# EAGLE schematic DMFX-1 v1.2 (EAGLE 6.3), part 1 of 2

## Sheet 1 of 12
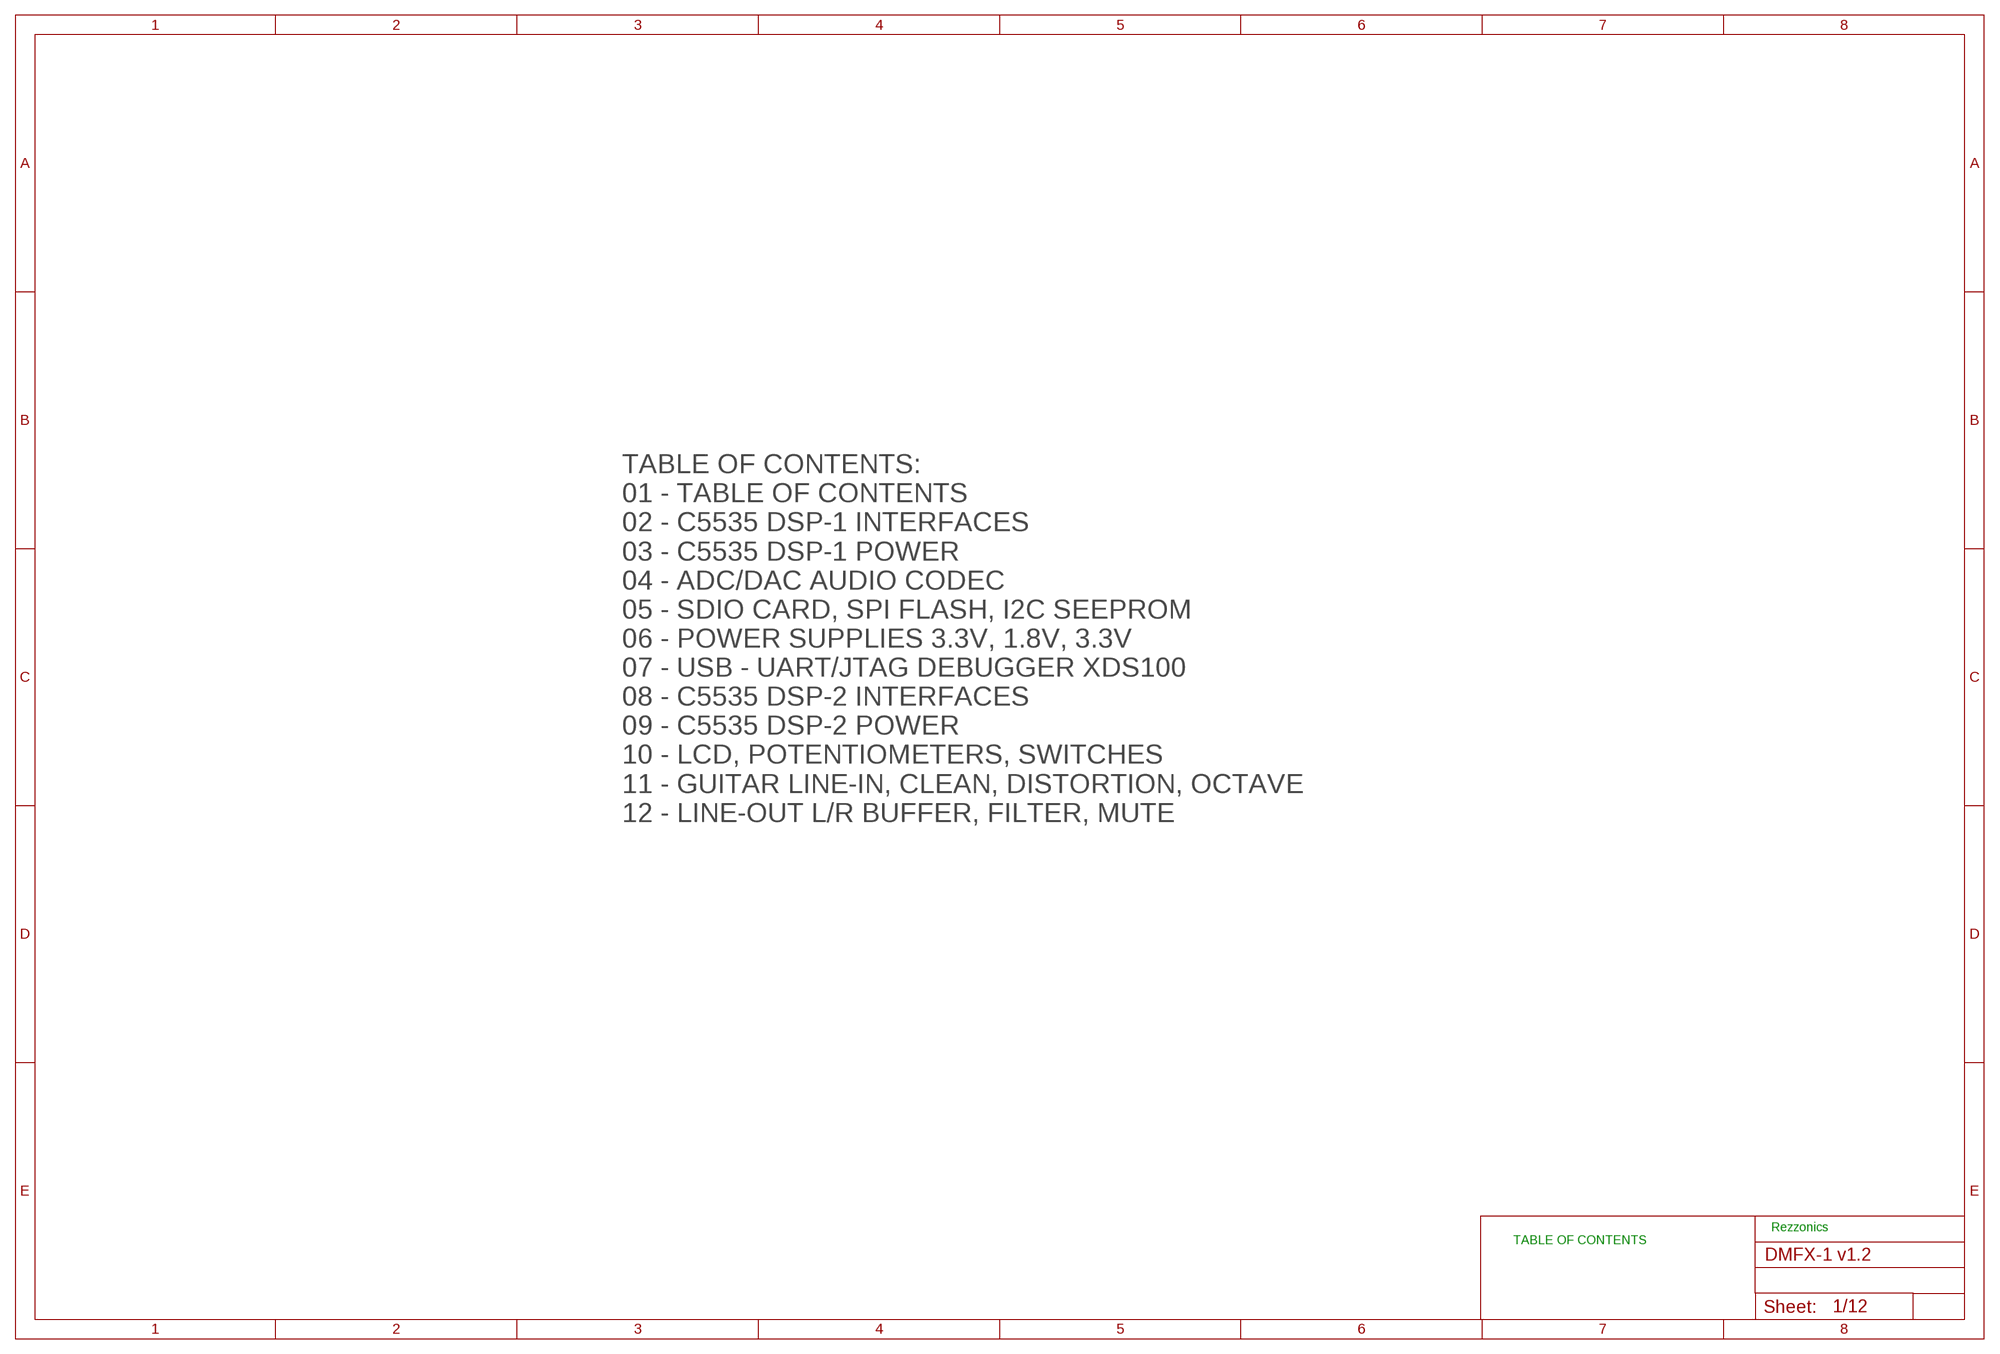
[diagram p0: schematic, sheet 1]

### Notes on the sheet
- TABLE OF CONTENTS:
  01 - TABLE OF CONTENTS
  02 - C5535 DSP-1 INTERFACES
  03 - C5535 DSP-1 POWER
  04 - ADC/DAC AUDIO CODEC
  05 - SDIO CARD, SPI FLASH, I2C SEEPROM
  06 - POWER SUPPLIES 3.3V, 1.8V, 3.3V
  07 - USB - UART/JTAG DEBUGGER XDS100
  08 - C5535 DSP-2 INTERFACES
  09 - C5535 DSP-2 POWER
  10 - LCD, POTENTIOMETERS, SWITCHES
  11 - GUITAR LINE-IN, CLEAN, DISTORTION, OCTAVE
  12 - LINE-OUT L/R BUFFER, FILTER, MUTE
- Rezzonics
- TABLE OF CONTENTS

## Sheet 2 of 12
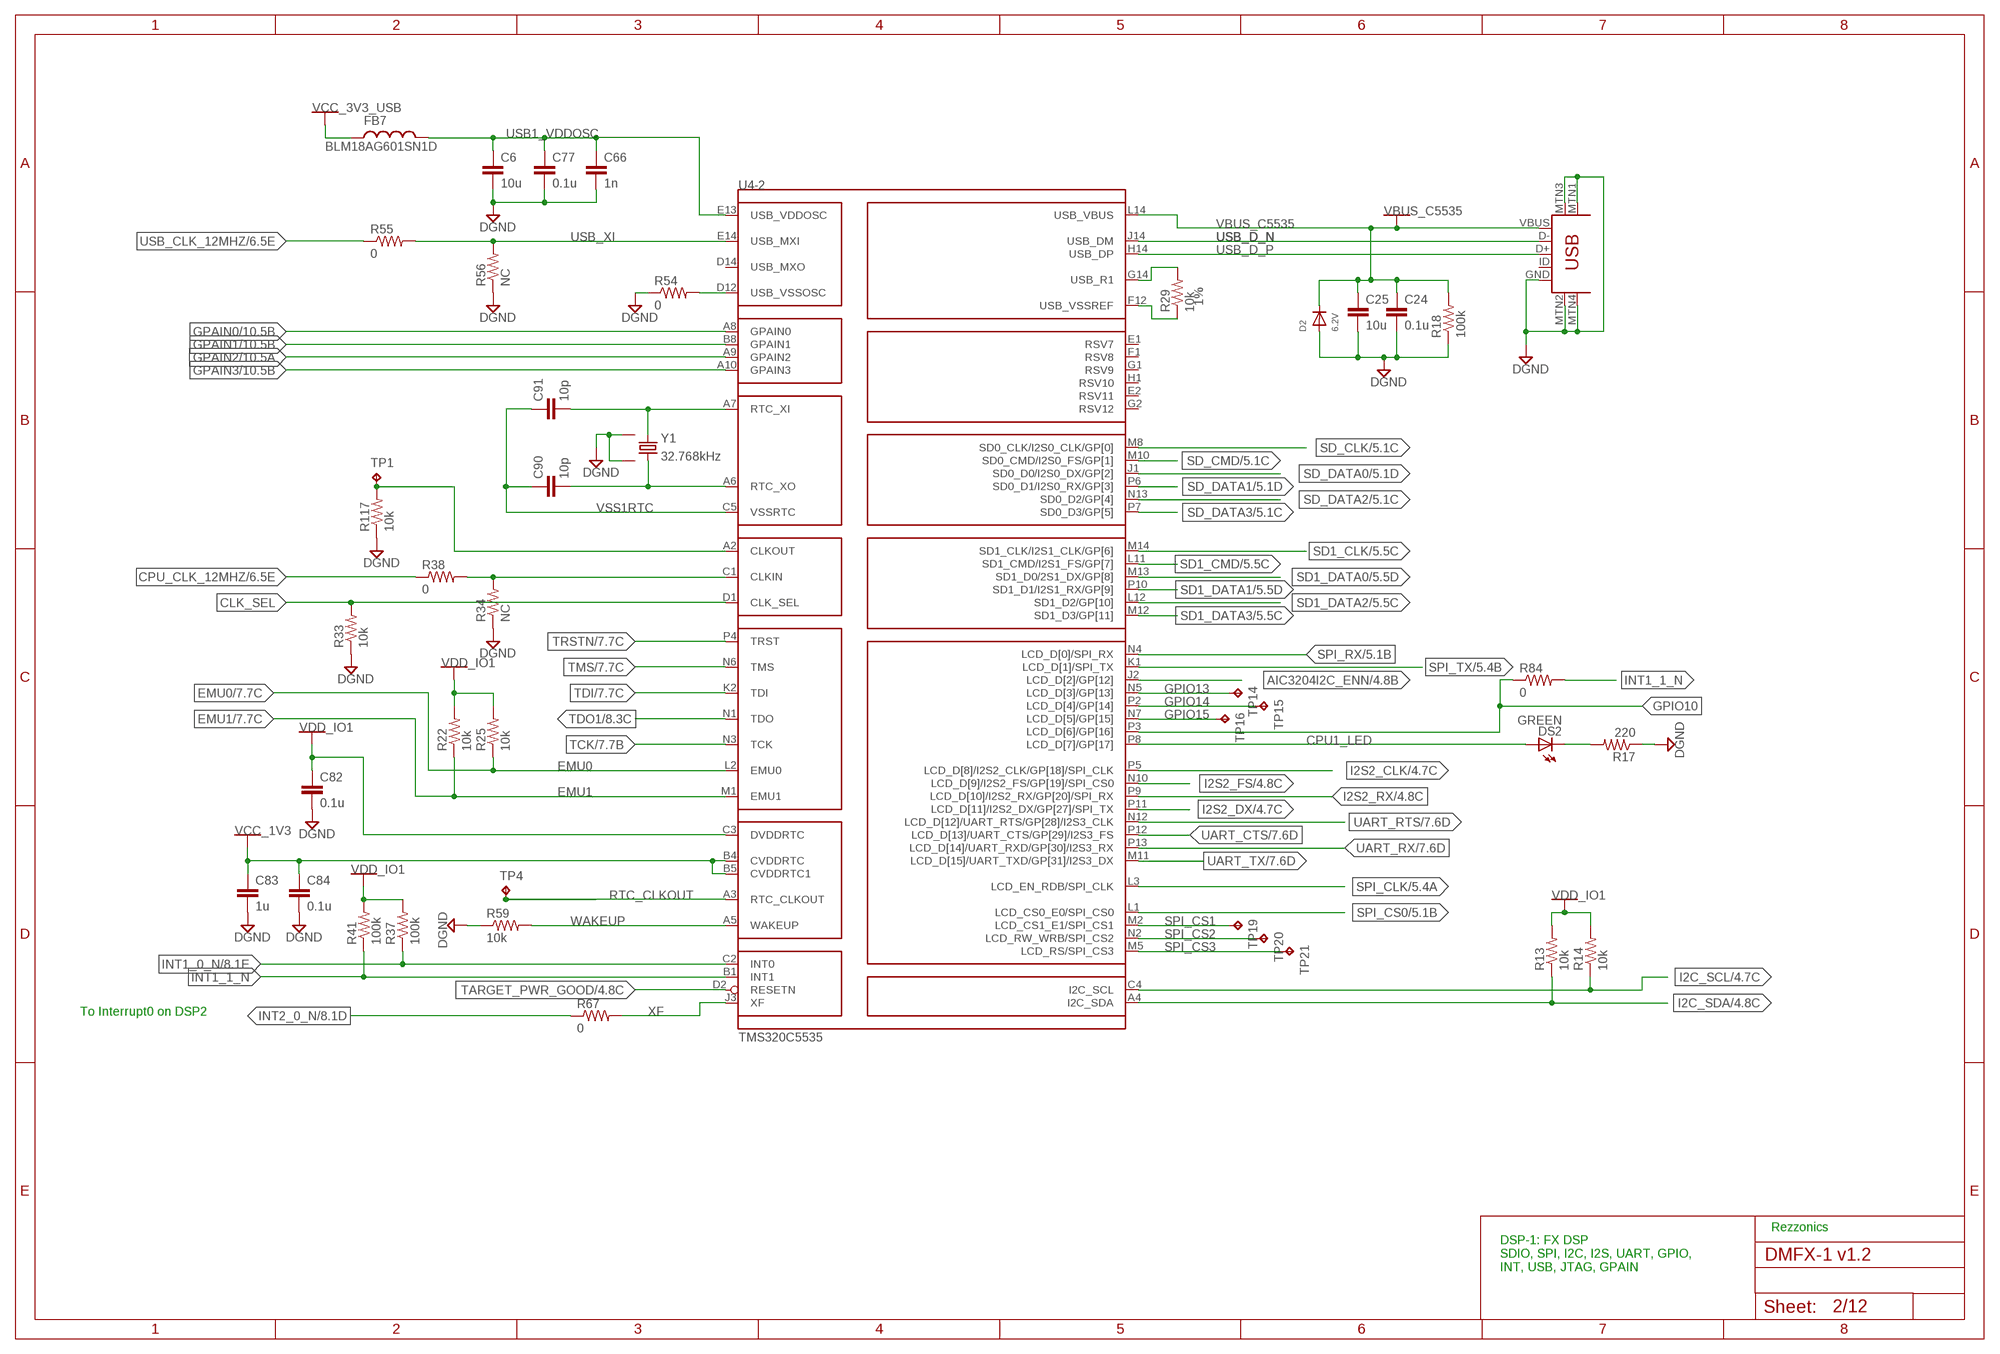
[diagram p1: schematic, sheet 2]

### Parts
C6  10u  C-EUC0603K  [C0603K]
C24  0.1u  C-EUC0402K  [C0402K]
C25  10u  C-EUC0603K  [C0603K]
C66  1n  C0402_BGA  [0402]
C77  0.1u  C-EUC0402K  [C0402K]
C82  0.1u  C0402_BGA  [0402]
C83  1u  C0402_BGA  [0402]
C84  0.1u  C0402_BGA  [0402]
C90  10p  C-EUC0402K  [C0402K]
C91  10p  C-EUC0402K  [C0402K]
D2  6.2V  DIODESMA  [SMADIODE]
DS2  GREEN  LEDCHIPLED_0603  [CHIPLED_0603]
FB7  BLM18AG601SN1D  INDUCTOR0805  [0805]
J1  USB-MINIB-5PIN  [USB-MINIB]
R13  10k  RESISTOR0402-RES  [0402-RES]
R14  10k  RESISTOR0402-RES  [0402-RES]
R17  220  RESISTOR0402-RES  [0402-RES]
R18  100k  RESISTOR0402-RES  [0402-RES]
R22  10k  RESISTOR0402-RES  [0402-RES]
R25  10k  RESISTOR0402-RES  [0402-RES]
R29  10k  CRCW04021K00FKED  [0402]
R33  10k  RESISTOR0402-RES  [0402-RES]
R34  NC  CRCW04021K00FKED  [0402]
R37  100k  RESISTOR0402-RES  [0402-RES]
R38  0  CRCW04021K00FKED  [0402]
R41  100k  RESISTOR0402-RES  [0402-RES]
R54  0  CRCW04021K00FKED  [0402]
R55  0  RESISTOR0402-RES  [0402-RES]
R56  NC  RESISTOR0402-RES  [0402-RES]
R59  10k  RESISTOR0402-RES  [0402-RES]
R67  0  CRCW04021K00FKED  [0402]
R84  0  RESISTOR0402-RES  [0402-RES]
R117  10k  RESISTOR0402-RES  [0402-RES]
TP1  TPTP06R  [TP06R]
TP4  TPTP06R  [TP06R]
TP14  TPTP06R  [TP06R]
TP15  TPTP06R  [TP06R]
TP16  TPTP06R  [TP06R]
TP19  TPTP06R  [TP06R]
TP20  TPTP06R  [TP06R]
TP21  TPTP06R  [TP06R]
U4  TMS320C5535  TMS320C5535S-PBGA-N144  [PBGA144]
Y1  32.768kHz  CRYSTAL  [CRYSTAL-32KHZ-SMD_EPSON_MC146]

### Nets
AIC3204I2C_ENN: U4.J2(-2:LCD_D[2]/GP[12]) ; also sheet 4
CLK_SEL: R33.2 U4.D1(-2:CLK_SEL)
CPU1_LED: DS2.A U4.P8(-2:LCD_D[7]/GP[17])
CPU_CLK_12MHZ: R38.1 ; also sheet 6
DGND [POWER]: C6.2 C24.2 C25.2 C66.2 C77.2 C82.2 C83.2 C84.2 D2.A J1.GND J1.MTN1(MTN2) J1.MTN2(MTN3) J1.MTN3(MTN1) J1.MTN4 R17.1 R18.1 R33.1 R34.1 R54.1 R56.1 R59.1 R117.1 Y1.NC1 Y1.NC2 ; also sheet 3,4,5,6,7,8,9,10,11,12
EMU0: R25.1 U4.L2(-2:EMU0) ; also sheet 7,8
EMU1: R22.1 U4.M1(-2:EMU1) ; also sheet 7,8
GPAIN0: U4.A8(-2:GPAIN0) ; also sheet 10
GPAIN1: U4.B8(-2:GPAIN1) ; also sheet 10
GPAIN2: U4.A9(-2:GPAIN2) ; also sheet 10
GPAIN3: U4.A10(-2:GPAIN3) ; also sheet 10
GPIO10: R84.1 U4.P3(-2:LCD_D[6]/GP[16])
GPIO13: TP14.TP U4.N5(-2:LCD_D[3]/GP[13])
GPIO14: TP15.TP U4.P2(-2:LCD_D[4]/GP[14])
GPIO15: TP16.TP U4.N7(-2:LCD_D[5]/GP[15])
I2C_SCL: R14.1 U4.C4(-2:I2C_SCL) ; also sheet 4,5
I2C_SDA: R13.1 U4.A4(-2:I2C_SDA) ; also sheet 4,5
I2S2_CLK: U4.P5(-2:LCD_D[8]/I2S2_CLK/GP[18]/SPI_CLK) ; also sheet 4
I2S2_DX: U4.P11(-2:LCD_D[11]/I2S2_DX/GP[27]/SPI_TX) ; also sheet 4
I2S2_FS: U4.N10(-2:LCD_D[9]/I2S2_FS/GP[19]/SPI_CS0) ; also sheet 4
I2S2_RX: U4.P9(-2:LCD_D[10]/I2S2_RX/GP[20]/SPI_RX) ; also sheet 4
INT1_0_N: R37.1 U4.C2(-2:INT0) ; also sheet 8
INT1_1_N: R41.1 R84.2 U4.B1(-2:INT1)
INT2_0_N: R67.1 ; also sheet 8
N$5: C91.2 U4.A7(-2:RTC_XI) Y1.P$2
N$14: C90.2 U4.A6(-2:RTC_XO) Y1.P$1
N$17: R117.2 TP1.TP U4.A2(-2:CLKOUT)
N$18: R34.2 R38.2 U4.C1(-2:CLKIN)
N$20: DS2.C R17.2
N$21: R29.2 U4.G14(-2:USB_R1)
RTC_CLKOUT: TP4.TP U4.A3(-2:RTC_CLKOUT)
SD1_CLK: U4.M14(-2:SD1_CLK/I2S1_CLK/GP[6]) ; also sheet 5
SD1_CMD: U4.L11(-2:SD1_CMD/I2S1_FS/GP[7]) ; also sheet 5
SD1_DATA0: U4.M13(-2:SD1_D0/2S1_DX/GP[8]) ; also sheet 5
SD1_DATA1: U4.P10(-2:SD1_D1/I2S1_RX/GP[9]) ; also sheet 5
SD1_DATA2: U4.L12(-2:SD1_D2/GP[10]) ; also sheet 5
SD1_DATA3: U4.M12(-2:SD1_D3/GP[11]) ; also sheet 5
SD_CLK: U4.M8(-2:SD0_CLK/I2S0_CLK/GP[0]) ; also sheet 5
SD_CMD: U4.M10(-2:SD0_CMD/I2S0_FS/GP[1]) ; also sheet 5
SD_DATA0: U4.J1(-2:SD0_D0/I2S0_DX/GP[2]) ; also sheet 5
SD_DATA1: U4.P6(-2:SD0_D1/I2S0_RX/GP[3]) ; also sheet 5
SD_DATA2: U4.N13(-2:SD0_D2/GP[4]) ; also sheet 5
SD_DATA3: U4.P7(-2:SD0_D3/GP[5]) ; also sheet 5
SPI_CLK: U4.L3(-2:LCD_EN_RDB/SPI_CLK) ; also sheet 5
SPI_CS0: U4.L1(-2:LCD_CS0_E0/SPI_CS0) ; also sheet 5
SPI_CS1: TP19.TP U4.M2(-2:LCD_CS1_E1/SPI_CS1)
SPI_CS2: TP20.TP U4.N2(-2:LCD_RW_WRB/SPI_CS2)
SPI_CS3: TP21.TP U4.M5(-2:LCD_RS/SPI_CS3)
SPI_RX: U4.N4(-2:LCD_D[0]/SPI_RX) ; also sheet 5
SPI_TX: U4.K1(-2:LCD_D[1]/SPI_TX) ; also sheet 5
TARGET_PWR_GOOD: U4.D2(-2:RESETN) ; also sheet 4,6,7,8,10
TCK: U4.N3(-2:TCK) ; also sheet 7,8
TDI: U4.K2(-2:TDI) ; also sheet 7
TDO1: U4.N1(-2:TDO) ; also sheet 8
TMS: U4.N6(-2:TMS) ; also sheet 7,8
TRSTN: U4.P4(-2:TRST) ; also sheet 7,8
UART_CTS: U4.P12(-2:LCD_D[13]/UART_CTS/GP[29]/I2S3_FS) ; also sheet 7
UART_RTS: U4.N12(-2:LCD_D[12]/UART_RTS/GP[28]/I2S3_CLK) ; also sheet 7
UART_RX: U4.P13(-2:LCD_D[14]/UART_RXD/GP[30]/I2S3_RX) ; also sheet 7
UART_TX: U4.M11(-2:LCD_D[15]/UART_TXD/GP[31]/I2S3_DX) ; also sheet 7
USB1_VDDOSC [POWER]: C6.1 C66.1 C77.1 FB7.2 U4.E13(-2:USB_VDDOSC)
USB1_VSSOSC: R54.2 U4.D12(-2:USB_VSSOSC)
USB1_VSSREF: R29.1 U4.F12(-2:USB_VSSREF)
USB_CLK_12MHZ: R55.1 ; also sheet 6
USB_D_N: J1.D- U4.J14(-2:USB_DM)
USB_D_P: J1.D+ U4.H14(-2:USB_DP)
USB_XI: R55.2 R56.2 U4.E14(-2:USB_MXI)
VBUS_C5535 [POWER]: C24.1 C25.1 D2.C J1.VBUS R18.2 U4.L14(-2:USB_VBUS) ; also sheet 7
VCC_1V3: C83.1 C84.1 U4.B4(-2:CVDDRTC) U4.B5(-2:CVDDRTC1) ; also sheet 3,6,8,9
VCC_3V3_USB [POWER]: FB7.1 ; also sheet 3,6,8,9
VDD_IO1: C82.1 R13.2 R14.2 R22.2 R25.2 R37.2 R41.2 U4.C3(-2:DVDDRTC) ; also sheet 5,6
VSS1RTC: C90.1 C91.1 U4.C5(-2:VSSRTC)
WAKEUP: R59.2 U4.A5(-2:WAKEUP)
XF: R67.2 U4.J3(-2:XF)
Unconnected: J1.ID U4.D14(-2:USB_MXO) U4.E1(-2:RSV7) U4.E2(-2:RSV11) U4.F1(-2:RSV8) U4.G1(-2:RSV9) U4.G2(-2:RSV12) U4.H1(-2:RSV10)

### Notes on the sheet
- To Interrupt0 on DSP2
- Rezzonics
- DSP-1: FX DSP
  SDIO, SPI, I2C, I2S, UART, GPIO, 
  INT, USB, JTAG, GPAIN

## Sheet 3 of 12
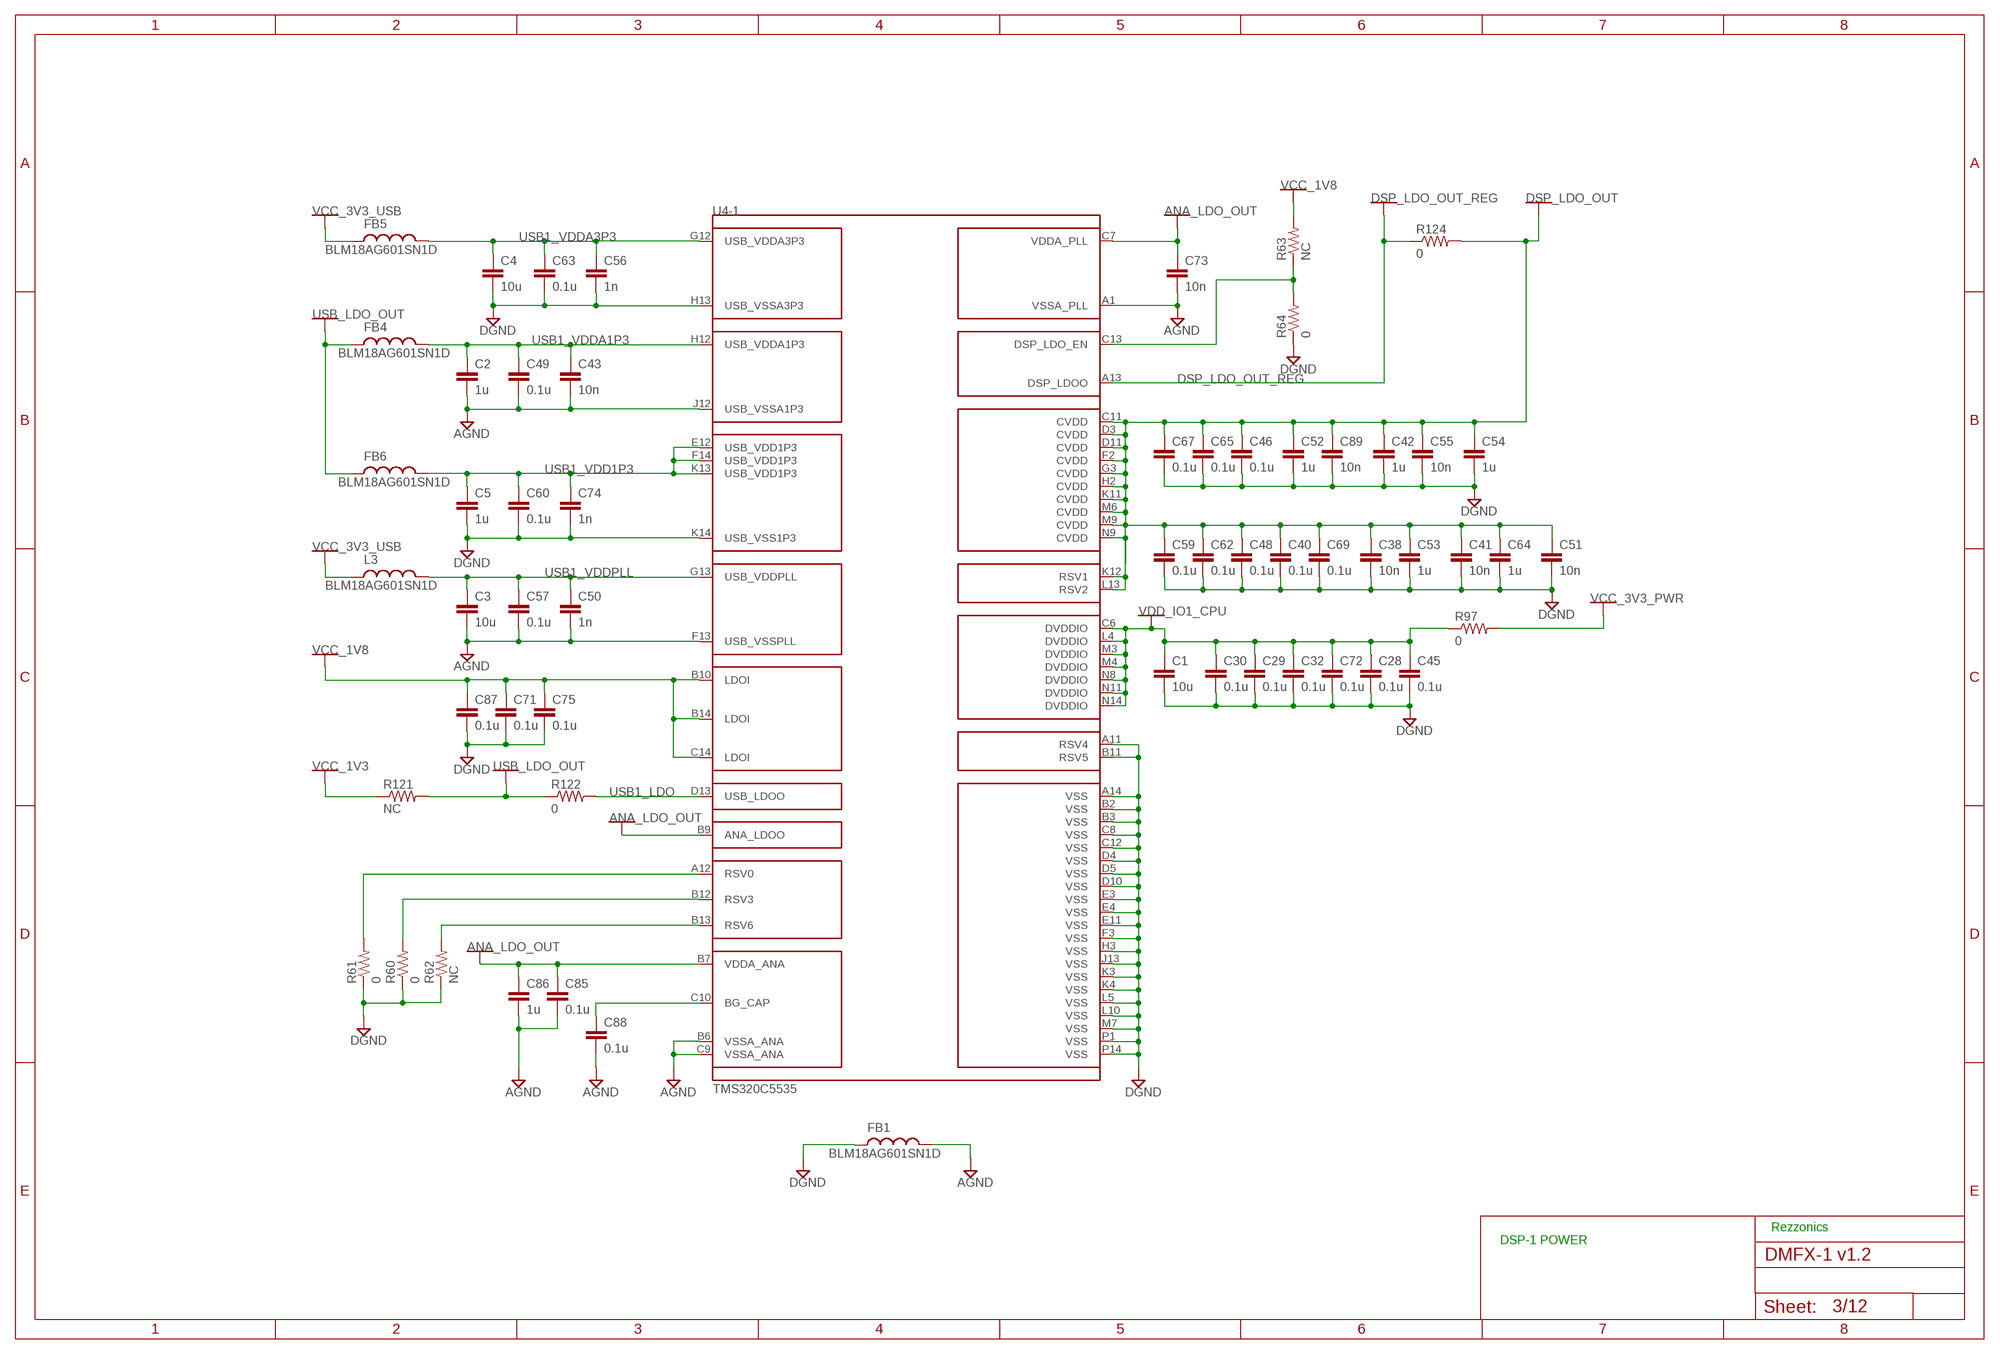
[diagram p2: schematic, sheet 3]

### Parts
C1  10u  C-EUC0603K  [C0603K]
C2  1u  C-EUC0402K  [C0402K]
C3  10u  C-EUC0603K  [C0603K]
C4  10u  C-EUC0603K  [C0603K]
C5  1u  C-EUC0402K  [C0402K]
C28  0.1u  C-EUC0402K  [C0402K]
C29  0.1u  C-EUC0402K  [C0402K]
C30  0.1u  C-EUC0402K  [C0402K]
C32  0.1u  C0402_BGA  [0402]
C38  10n  C0402_BGA  [0402]
C40  0.1u  C0402_BGA  [0402]
C41  10n  C0402_BGA  [0402]
C42  1u  C0402_BGA  [0402]
C43  10n  C0402_BGA  [0402]
C45  0.1u  C0402_BGA  [0402]
C46  0.1u  C0402_BGA  [0402]
C48  0.1u  C0402_BGA  [0402]
C49  0.1u  C0402_BGA  [0402]
C50  1n  C0402_BGA  [0402]
C51  10n  C0402_BGA  [0402]
C52  1u  C0402_BGA  [0402]
C53  1u  C0402_BGA  [0402]
C54  1u  C0402_BGA  [0402]
C55  10n  C0402_BGA  [0402]
C56  1n  C0402_BGA  [0402]
C57  0.1u  C0402_BGA  [0402]
C59  0.1u  C0402_BGA  [0402]
C60  0.1u  C0402_BGA  [0402]
C62  0.1u  C0402_BGA  [0402]
C63  0.1u  C0402_BGA  [0402]
C64  1u  C0402_BGA  [0402]
C65  0.1u  C0402_BGA  [0402]
C67  0.1u  C0402_BGA  [0402]
C69  0.1u  C0402_BGA  [0402]
C71  0.1u  C0402_BGA  [0402]
C72  0.1u  C0402_BGA  [0402]
C73  10n  C0402_BGA  [0402]
C74  1n  C-EUC0402K  [C0402K]
C75  0.1u  C0402_BGA  [0402]
C85  0.1u  C0402_BGA  [0402]
C86  1u  C0402_BGA  [0402]
C87  0.1u  C0402_BGA  [0402]
C88  0.1u  C0402_BGA  [0402]
C89  10n  C-EUC0402K  [C0402K]
FB1  BLM18AG601SN1D  INDUCTOR0603  [0603]
FB4  BLM18AG601SN1D  INDUCTOR0603  [0603]
FB5  BLM18AG601SN1D  INDUCTOR0603  [0603]
FB6  BLM18AG601SN1D  INDUCTOR0603  [0603]
L3  BLM18AG601SN1D  INDUCTOR0603  [0603]
R60  0  RESISTOR0402-RES  [0402-RES]
R61  0  RESISTOR0402-RES  [0402-RES]
R62  NC  RESISTOR0402-RES  [0402-RES]
R63  NC  RESISTOR0402-RES  [0402-RES]
R64  0  RESISTOR0402-RES  [0402-RES]
R97  0  RESISTOR0805-RES  [0805]
R121  NC  RESISTOR0805-RES  [0805]
R122  0  RESISTOR0805-RES  [0805]
R124  0  RESISTOR0805-RES  [0805]

### Nets
AGND [POWER]: C2.2 C3.2 C43.2 C49.2 C50.2 C57.2 C73.2 C85.2 C86.2 C88.2 FB1.2 U4.A1(-1:VSSA_PLL) U4.B6(-1:VSSA_ANA) U4.C9(-1:VSSA_ANA) U4.F13(-1:USB_VSSPLL) U4.J12(-1:USB_VSSA1P3) ; also sheet 9
ANA_LDO_OUT: C73.1 C85.1 C86.1 U4.B7(-1:VDDA_ANA) U4.B9(-1:ANA_LDOO) U4.C7(-1:VDDA_PLL)
DGND [POWER]: C1.2 C4.2 C5.2 C28.2 C29.2 C30.2 C32.2 C38.2 C40.2 C41.2 C42.2 C45.2 C46.2 C48.2 C51.2 C52.2 C53.2 C54.2 C55.2 C56.2 C59.2 C60.2 C62.2 C63.2 C64.2 C65.2 C67.2 C69.2 C71.2 C72.2 C74.2 C75.2 C87.2 C89.2 FB1.1 R60.1 R61.1 R62.1 R64.1 U4.A11(-1:RSV4) U4.A14(-1:VSS) U4.B2(-1:VSS) U4.B3(-1:VSS) U4.B11(-1:RSV5) U4.C8(-1:VSS) U4.C12(-1:VSS) U4.D4(-1:VSS) U4.D5(-1:VSS) U4.D10(-1:VSS) U4.E3(-1:VSS) U4.E4(-1:VSS) U4.E11(-1:VSS) U4.F3(-1:VSS) U4.H3(-1:VSS) U4.H13(-1:USB_VSSA3P3) U4.J13(-1:VSS) U4.K3(-1:VSS) U4.K4(-1:VSS) U4.K14(-1:USB_VSS1P3) U4.L5(-1:VSS) U4.L10(-1:VSS) U4.M7(-1:VSS) U4.P1(-1:VSS) U4.P14(-1:VSS) ; also sheet 2,4,5,6,7,8,9,10,11,12
DSP_LDO_OUT: C38.1 C40.1 C41.1 C42.1 C46.1 C48.1 C51.1 C52.1 C53.1 C54.1 C55.1 C59.1 C62.1 C64.1 C65.1 C67.1 C69.1 C89.1 R124.2 U4.C11(-1:CVDD) U4.D3(-1:CVDD) U4.D11(-1:CVDD) U4.F2(-1:CVDD) U4.G3(-1:CVDD) U4.H2(-1:CVDD) U4.K11(-1:CVDD) U4.K12(-1:RSV1) U4.L13(-1:RSV2) U4.M6(-1:CVDD) U4.M9(-1:CVDD) U4.N9(-1:CVDD)
DSP_LDO_OUT_REG: R124.1 U4.A13(-1:DSP_LDOO)
N$1: R63.1 R64.2 U4.C13(-1:DSP_LDO_EN)
N$11: R61.2 U4.A12(-1:RSV0)
N$12: R60.2 U4.B12(-1:RSV3)
N$13: R62.2 U4.B13(-1:RSV6)
N$15: C88.1 U4.C10(-1:BG_CAP)
USB1_LDO: R122.2 U4.D13(-1:USB_LDOO)
USB1_VDD1P3 [POWER]: C5.1 C60.1 C74.1 FB6.2 U4.E12(-1:USB_VDD1P3) U4.F14(-1:USB_VDD1P3) U4.K13(-1:USB_VDD1P3)
USB1_VDDA1P3 [POWER]: C2.1 C43.1 C49.1 FB4.2 U4.H12(-1:USB_VDDA1P3)
USB1_VDDA3P3: C4.1 C56.1 C63.1 FB5.2 U4.G12(-1:USB_VDDA3P3)
USB1_VDDPLL: C3.1 C50.1 C57.1 L3.2 U4.G13(-1:USB_VDDPLL)
USB_LDO_OUT: FB4.1 FB6.1 R121.2 R122.1
VCC_1V3: R121.1 ; also sheet 2,6,8,9
VCC_1V8: C71.1 C75.1 C87.1 R63.2 U4.B10(-1:LDOI) U4.B14(-1:LDOI) U4.C14(-1:LDOI) ; also sheet 4,6,9
VCC_3V3_PWR: R97.2 ; also sheet 6,9
VCC_3V3_USB [POWER]: FB5.1 L3.1 ; also sheet 2,6,8,9
VDD_IO1_CPU [POWER]: C1.1 C28.1 C29.1 C30.1 C32.1 C45.1 C72.1 R97.1 U4.C6(-1:DVDDIO) U4.L4(-1:DVDDIO) U4.M3(-1:DVDDIO) U4.M4(-1:DVDDIO) U4.N8(-1:DVDDIO) U4.N11(-1:DVDDIO) U4.N14(-1:DVDDIO)

### Notes on the sheet
- Rezzonics
- DSP-1 POWER

## Sheet 4 of 12
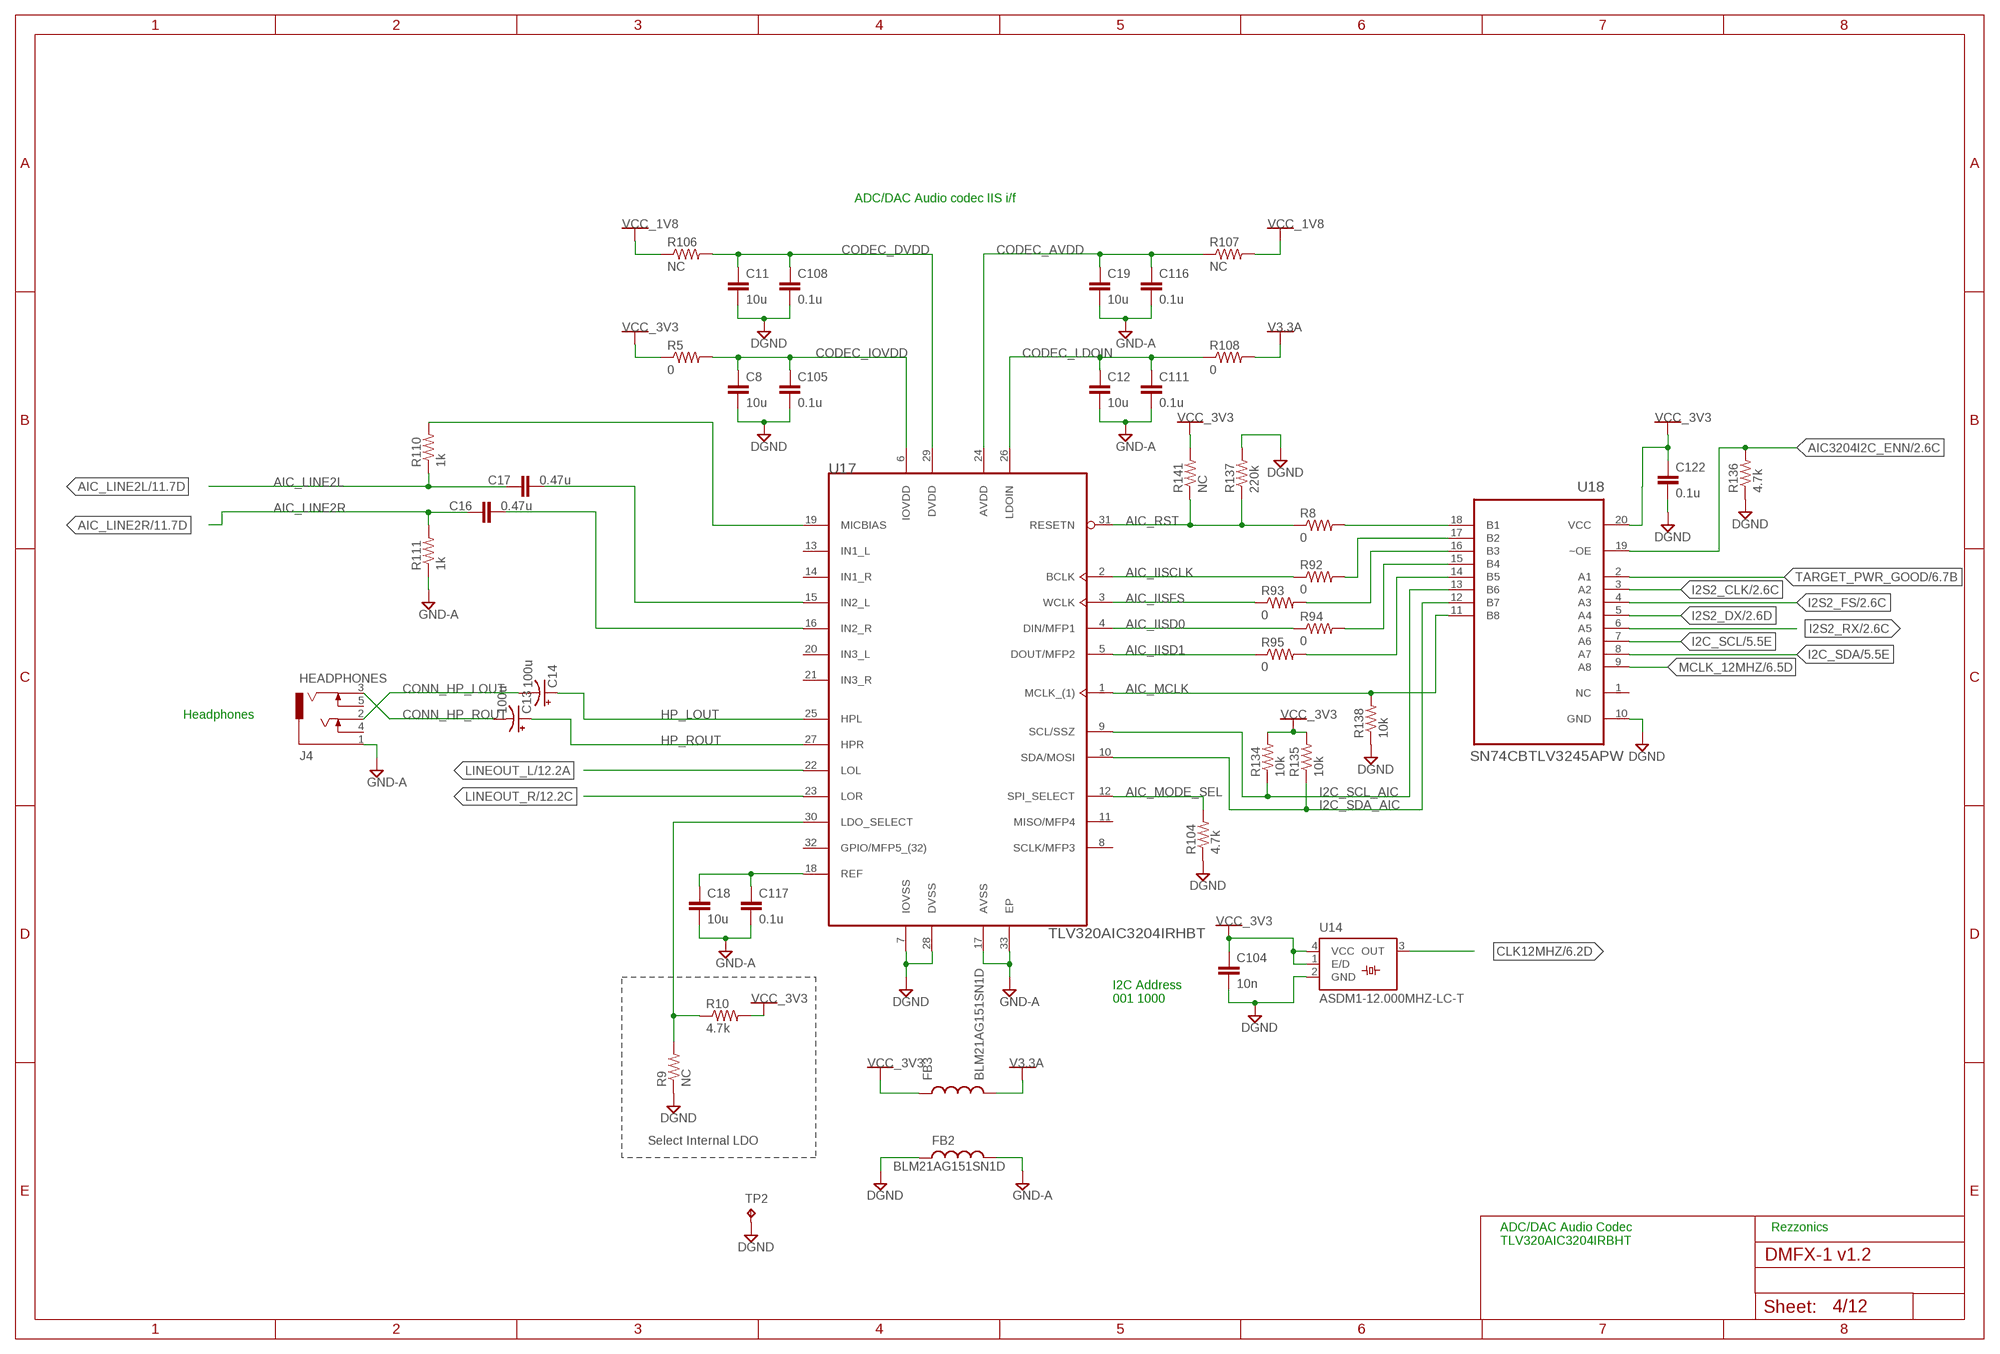
[diagram p3: schematic, sheet 4]

### Parts
C8  10u  C-EUC0603K  [C0603K]
C11  10u  C-EUC0603K  [C0603K]
C12  10u  C-EUC0603K  [C0603K]
C13  100u  CPOL-US1411  [1411]
C14  100u  CPOL-US1411  [1411]
C16  0.47u  C-EUC0603K  [C0603K]
C17  0.47u  C-EUC0603K  [C0603K]
C18  10u  C-EUC0603K  [C0603K]
C19  10u  C-EUC0603K  [C0603K]
C104  10n  C-EUC0402K  [C0402K]
C105  0.1u  C-EUC0402K  [C0402K]
C108  0.1u  C-EUC0402K  [C0402K]
C111  0.1u  C-EUC0402K  [C0402K]
C116  0.1u  C-EUC0402K  [C0402K]
C117  0.1u  C-EUC0402K  [C0402K]
C122  0.1u  C-EUC0402K  [C0402K]
FB2  BLM21AG151SN1D  INDUCTOR0805  [0805]
FB3  BLM21AG151SN1D  INDUCTOR0805  [0805]
J4  HEADPHONES  AUDIOJACK3_5SMD  [AUDIO-JACK-3.5MM-SMD]
R5  0  RESISTOR0402-RES  [0402-RES]
R8  0  RESISTOR0402-RES  [0402-RES]
R9  NC  RESISTOR0603-RES  [0603-RES]
R10  4.7k  RESISTOR0603-RES  [0603-RES]
R92  0  RESISTOR0402-RES  [0402-RES]
R93  0  RESISTOR0402-RES  [0402-RES]
R94  0  RESISTOR0402-RES  [0402-RES]
R95  0  RESISTOR0402-RES  [0402-RES]
R104  4.7k  RESISTOR0402-RES  [0402-RES]
R106  NC  RESISTOR0402-RES  [0402-RES]
R107  NC  RESISTOR0402-RES  [0402-RES]
R108  0  RESISTOR0402-RES  [0402-RES]
R110  1k  RESISTOR0402-RES  [0402-RES]
R111  1k  RESISTOR0402-RES  [0402-RES]
R134  10k  RESISTOR0402-RES  [0402-RES]
R135  10k  RESISTOR0402-RES  [0402-RES]
R136  4.7k  RESISTOR0402-RES  [0402-RES]
R137  220k  RESISTOR0402-RES  [0402-RES]
R138  10k  RESISTOR0402-RES  [0402-RES]
R141  NC  RESISTOR0402-RES  [0402-RES]
TP2  TPTP06R  [TP06R]
U14  ASDM1-12.000MHZ-LC-T  ASDM  [ASDM1]
U17  TLV320AIC3204IRHBT  [QFN50P500X500X100-33N]
U18  SN74CBTLV3245APW  [SOP65P640X120-20N]

### Nets
AIC3204I2C_ENN: R136.2 U18.19(~OE) ; also sheet 2
AIC_IISCLK: R92.1 U17.2(BCLK)
AIC_IISD0: R94.1 U17.4(DIN/MFP1)
AIC_IISD1: R95.1 U17.5(DOUT/MFP2)
AIC_IISFS: R93.1 U17.3(WCLK)
AIC_LINE2L: C17.1 R110.1 ; also sheet 11
AIC_LINE2R: C16.1 R111.2 ; also sheet 11
AIC_MCLK: R138.2 U17.1(MCLK_(1)) U18.11(B8)
AIC_MODE_SEL: R104.2 U17.12(SPI_SELECT)
AIC_RST: R8.1 R137.1 R141.1 U17.31(RESETN)
CLK12MHZ: U14.3(OUT) ; also sheet 6
CODEC_AVDD: C19.1 C116.1 R107.1 U17.24(AVDD)
CODEC_DVDD: C11.1 C108.1 R106.2 U17.29(DVDD)
CODEC_IOVDD: C8.1 C105.1 R5.2 U17.6(IOVDD)
CODEC_LDOIN: C12.1 C111.1 R108.1 U17.26(LDOIN)
CONN_HP_LOUT: C14.- J4.2(T)
CONN_HP_ROUT: C13.- J4.3(R)
DGND [POWER]: C8.2 C11.2 C104.2 C105.2 C108.2 C122.2 FB2.1 R9.1 R104.1 R136.1 R137.2 R138.1 TP2.TP U14.2(GND) U17.7(IOVSS) U17.28(DVSS) U18.10(GND) ; also sheet 2,3,5,6,7,8,9,10,11,12
GND-A [POWER]: C12.2 C18.2 C19.2 C111.2 C116.2 C117.2 FB2.2 J4.1(S) R111.1 U17.17(AVSS) U17.33(EP) ; also sheet 11,12
HP_LOUT: C14.+ U17.25(HPL)
HP_ROUT: C13.+ U17.27(HPR)
I2C_SCL: U18.7(A6) ; also sheet 2,5
I2C_SCL_AIC: R134.1 U17.9(SCL/SSZ) U18.13(B6)
I2C_SDA: U18.8(A7) ; also sheet 2,5
I2C_SDA_AIC: R135.1 U17.10(SDA/MOSI) U18.12(B7)
I2S2_CLK: U18.3(A2) ; also sheet 2
I2S2_DX: U18.5(A4) ; also sheet 2
I2S2_FS: U18.4(A3) ; also sheet 2
I2S2_RX: U18.6(A5) ; also sheet 2
LINEOUT_L: U17.22(LOL) ; also sheet 12
LINEOUT_R: U17.23(LOR) ; also sheet 12
MCLK_12MHZ: U18.9(A8) ; also sheet 6
N$4: C17.2 U17.15(IN2_L)
N$6: C16.2 U17.16(IN2_R)
N$23: R9.2 R10.1 U17.30(LDO_SELECT)
N$26: C18.1 C117.1 U17.18(REF)
N$32: R8.2 U18.18(B1)
N$36: R92.2 U18.17(B2)
N$37: R93.2 U18.16(B3)
N$38: R94.2 U18.15(B4)
N$39: R95.2 U18.14(B5)
N$46: R110.2 U17.19(MICBIAS)
TARGET_PWR_GOOD: U18.2(A1) ; also sheet 2,6,7,8,10
V3.3A: FB3.2 R108.2 ; also sheet 11,12
VCC_1V8: R106.1 R107.2 ; also sheet 3,6,9
VCC_3V3 [POWER]: C104.1 C122.1 FB3.1 R5.1 R10.2 R134.2 R135.2 R141.2 U14.1(E/D) U14.4(VCC) U18.20(VCC) ; also sheet 5,6,10
Unconnected: J4.4(TN) J4.5(RN) U17.8(SCLK/MFP3) U17.11(MISO/MFP4) U17.13(IN1_L) U17.14(IN1_R) U17.20(IN3_L) U17.21(IN3_R) U17.32(GPIO/MFP5_(32)) U18.1(NC)

### Notes on the sheet
- ADC/DAC Audio codec IIS i/f
- Headphones
- I2C Address
  001 1000
- Select Internal LDO
- ADC/DAC Audio Codec
  TLV320AIC3204IRBHT
- Rezzonics

## Sheet 5 of 12
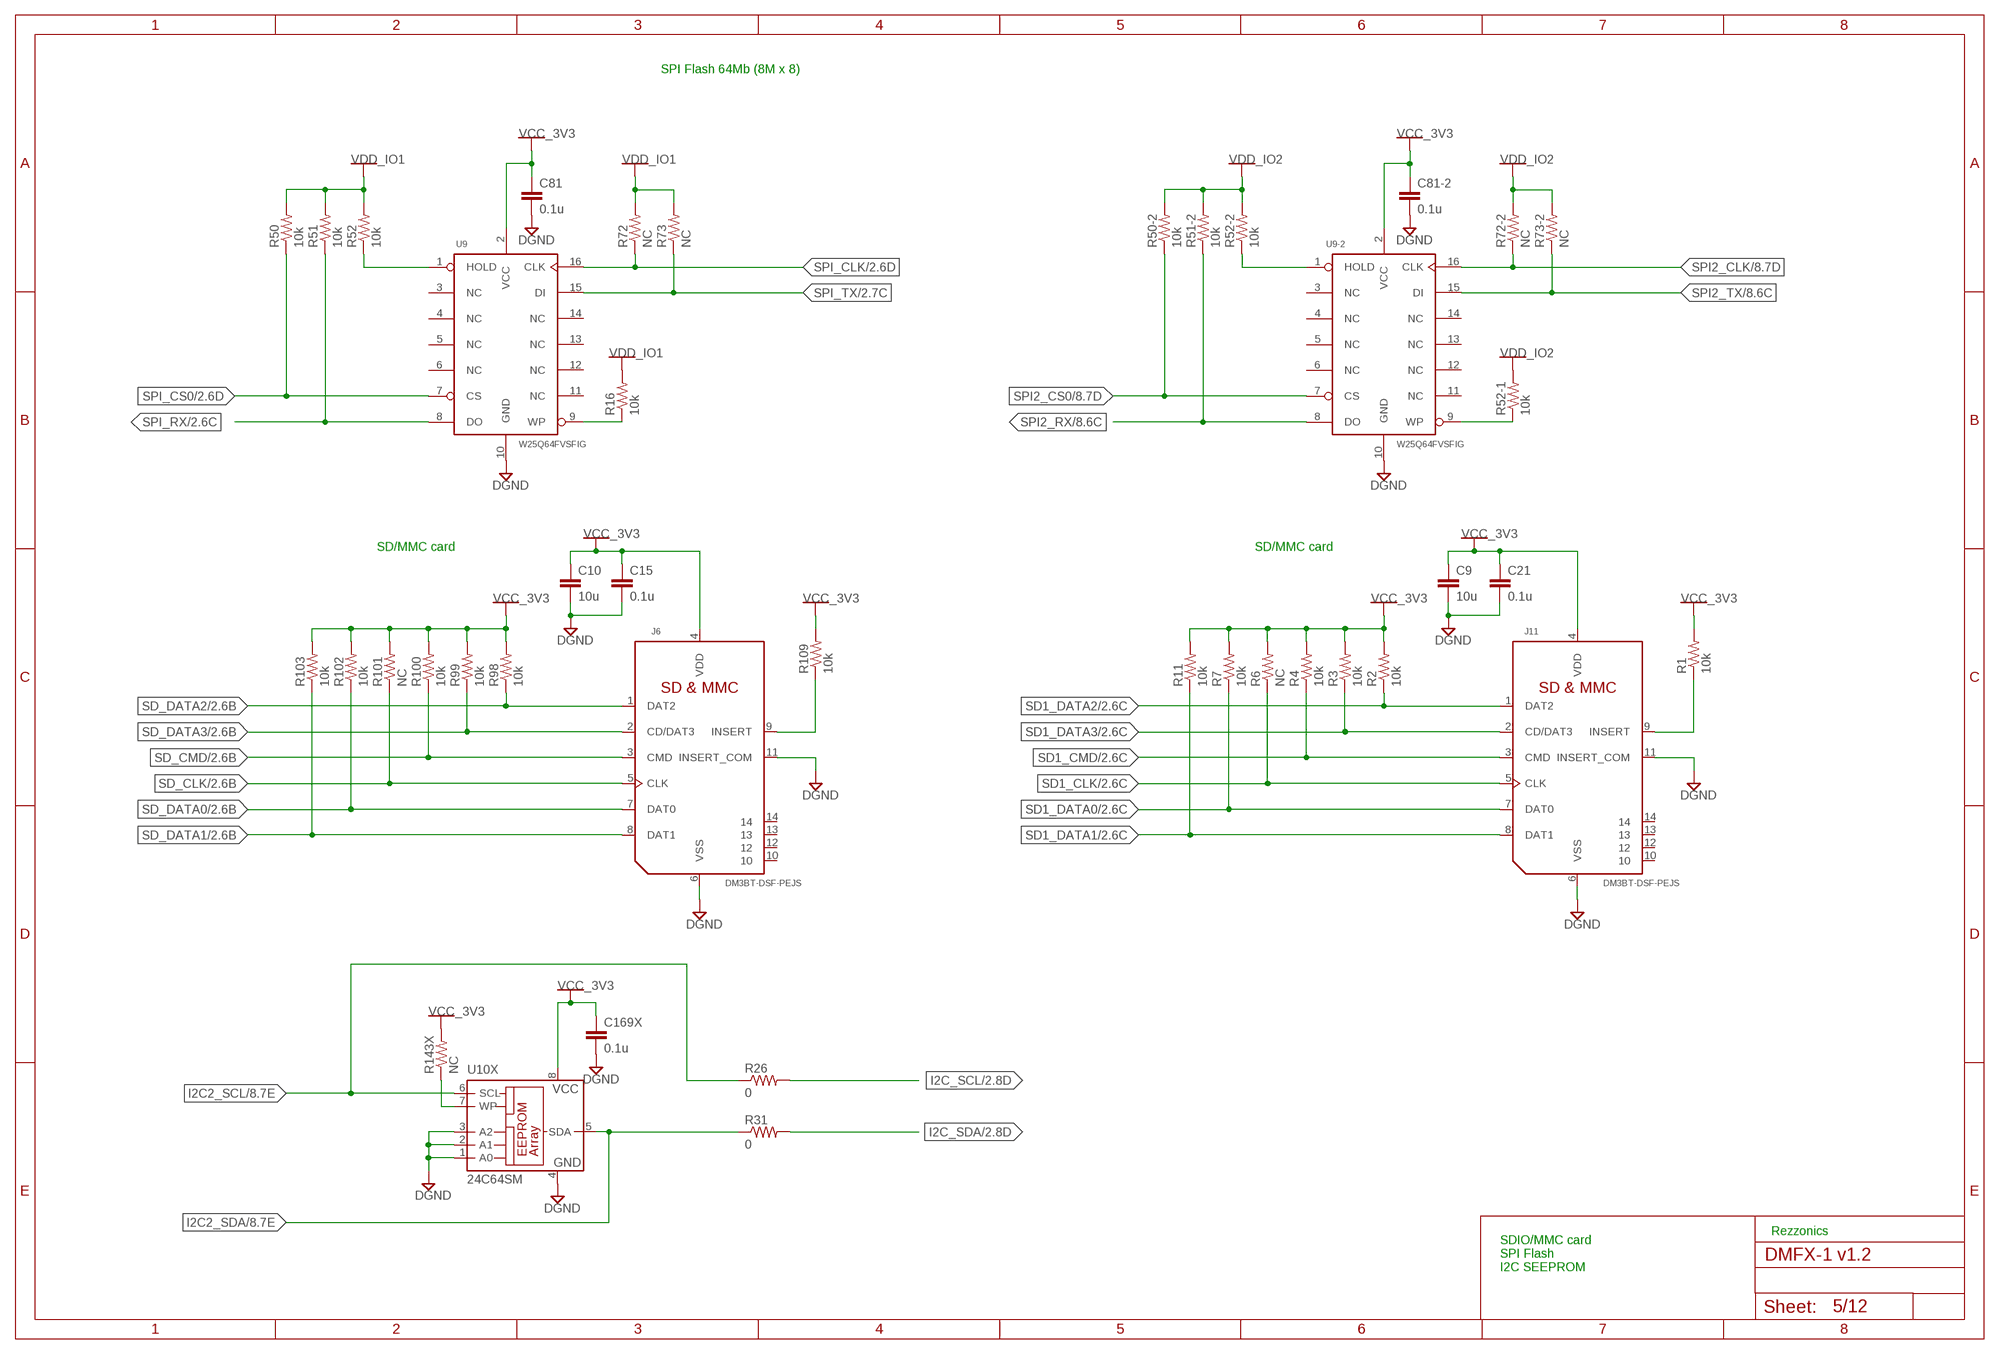
[diagram p4: schematic, sheet 5]

### Parts
C9  10u  C-EUC0603K  [C0603K]
C10  10u  C-EUC0603K  [C0603K]
C15  0.1u  C-EUC0402K  [C0402K]
C21  0.1u  C-EUC0402K  [C0402K]
C81  0.1u  C-EUC0402K  [C0402K]
C81-2  0.1u  C-EUC0402K  [C0402K]
C169X  0.1u  C-EUC0402K  [C0402K]
J6  DM3BT-DSF-PEJS  SDMMCRBT  [MICROSD_RBT]
J11  DM3BT-DSF-PEJS  SDMMCRBT  [MICROSD_RBT]
R1  10k  RESISTOR0402-RES  [0402-RES]
R2  10k  RESISTOR0402-RES  [0402-RES]
R3  10k  RESISTOR0402-RES  [0402-RES]
R4  10k  RESISTOR0402-RES  [0402-RES]
R6  NC  RESISTOR0402-RES  [0402-RES]
R7  10k  RESISTOR0402-RES  [0402-RES]
R11  10k  RESISTOR0402-RES  [0402-RES]
R16  10k  RESISTOR0402-RES  [0402-RES]
R26  0  RESISTOR0402-RES  [0402-RES]
R31  0  RESISTOR0402-RES  [0402-RES]
R50  10k  RESISTOR0402-RES  [0402-RES]
R50-2  10k  RESISTOR0402-RES  [0402-RES]
R51  10k  RESISTOR0402-RES  [0402-RES]
R51-2  10k  RESISTOR0402-RES  [0402-RES]
R52  10k  RESISTOR0402-RES  [0402-RES]
R52-1  10k  RESISTOR0402-RES  [0402-RES]
R52-2  10k  RESISTOR0402-RES  [0402-RES]
R72  NC  RESISTOR0402-RES  [0402-RES]
R72-2  NC  RESISTOR0402-RES  [0402-RES]
R73  NC  RESISTOR0402-RES  [0402-RES]
R73-2  NC  RESISTOR0402-RES  [0402-RES]
R98  10k  RESISTOR0402-RES  [0402-RES]
R99  10k  RESISTOR0402-RES  [0402-RES]
R100  10k  RESISTOR0402-RES  [0402-RES]
R101  NC  RESISTOR0402-RES  [0402-RES]
R102  10k  RESISTOR0402-RES  [0402-RES]
R103  10k  RESISTOR0402-RES  [0402-RES]
R109  10k  RESISTOR0402-RES  [0402-RES]
R143X  NC  RESISTOR0402-RES  [0402-RES]
U9  W25Q64FVSFIG  SPI_FLASH-X25XX  [SO16L]
U9-2  W25Q64FVSFIG  SPI_FLASH-X25XX  [SO16L]
U10X  24C64SM  [SO-08M]

### Nets
DGND [POWER]: C9.2 C10.2 C15.2 C21.2 C81-2.2 C81.2 C169X.2 J6.6(VSS) J6.11(INSERT_COM) J11.6(VSS) J11.11(INSERT_COM) U9-2.10(GND) U9.10(GND) U10X.1(A0) U10X.2(A1) U10X.3(A2) U10X.4(GND) ; also sheet 2,3,4,6,7,8,9,10,11,12
I2C2_SCL: R26.1 U10X.6(SCL) ; also sheet 8
I2C2_SDA: R31.1 U10X.5(SDA) ; also sheet 8
I2C_SCL: R26.2 ; also sheet 2,4
I2C_SDA: R31.2 ; also sheet 2,4
N$3: J11.9(INSERT) R1.1
N$7: R16.1 U9.9(WP)
N$8: R52-1.1 U9-2.9(WP)
N$24: R52.1 U9.1(HOLD)
N$30: J6.9(INSERT) R109.1
N$45: R52-2.1 U9-2.1(HOLD)
N$74: R143X.1 U10X.7(WP)
SD1_CLK: J11.5(CLK) R6.1 ; also sheet 2
SD1_CMD: J11.3(CMD) R4.1 ; also sheet 2
SD1_DATA0: J11.7(DAT0) R7.1 ; also sheet 2
SD1_DATA1: J11.8(DAT1) R11.1 ; also sheet 2
SD1_DATA2: J11.1(DAT2) R2.1 ; also sheet 2
SD1_DATA3: J11.2(CD/DAT3) R3.1 ; also sheet 2
SD_CLK: J6.5(CLK) R101.1 ; also sheet 2
SD_CMD: J6.3(CMD) R100.1 ; also sheet 2
SD_DATA0: J6.7(DAT0) R102.1 ; also sheet 2
SD_DATA1: J6.8(DAT1) R103.1 ; also sheet 2
SD_DATA2: J6.1(DAT2) R98.1 ; also sheet 2
SD_DATA3: J6.2(CD/DAT3) R99.1 ; also sheet 2
SPI2_CLK: R72-2.1 U9-2.16(CLK) ; also sheet 8,10
SPI2_CS0: R50-2.1 U9-2.7(CS) ; also sheet 8
SPI2_RX: R51-2.1 U9-2.8(DO) ; also sheet 8
SPI2_TX: R73-2.1 U9-2.15(DI) ; also sheet 8,10
SPI_CLK: R72.1 U9.16(CLK) ; also sheet 2
SPI_CS0: R50.1 U9.7(CS) ; also sheet 2
SPI_RX: R51.1 U9.8(DO) ; also sheet 2
SPI_TX: R73.1 U9.15(DI) ; also sheet 2
VCC_3V3 [POWER]: C9.1 C10.1 C15.1 C21.1 C81-2.1 C81.1 C169X.1 J6.4(VDD) J11.4(VDD) R1.2 R2.2 R3.2 R4.2 R6.2 R7.2 R11.2 R98.2 R99.2 R100.2 R101.2 R102.2 R103.2 R109.2 R143X.2 U9-2.2(VCC) U9.2(VCC) U10X.8(VCC) ; also sheet 4,6,10
VDD_IO1: R16.2 R50.2 R51.2 R52.2 R72.2 R73.2 ; also sheet 2,6
VDD_IO2: R50-2.2 R51-2.2 R52-1.2 R52-2.2 R72-2.2 R73-2.2 ; also sheet 6,8
Unconnected: J6.10 J6.12 J6.13 J6.14 J11.10 J11.12 J11.13 J11.14 U9-2.3(NC) U9-2.4(NC) U9-2.5(NC) U9-2.6(NC) U9-2.11(NC) U9-2.12(NC) U9-2.13(NC) U9-2.14(NC) U9.3(NC) U9.4(NC) U9.5(NC) U9.6(NC) U9.11(NC) U9.12(NC) U9.13(NC) U9.14(NC)

### Notes on the sheet
- SPI Flash 64Mb (8M x 8)
- SD/MMC card | SD/MMC card
- SDIO/MMC card
  SPI Flash
  I2C SEEPROM
- Rezzonics

## Sheet 6 of 12
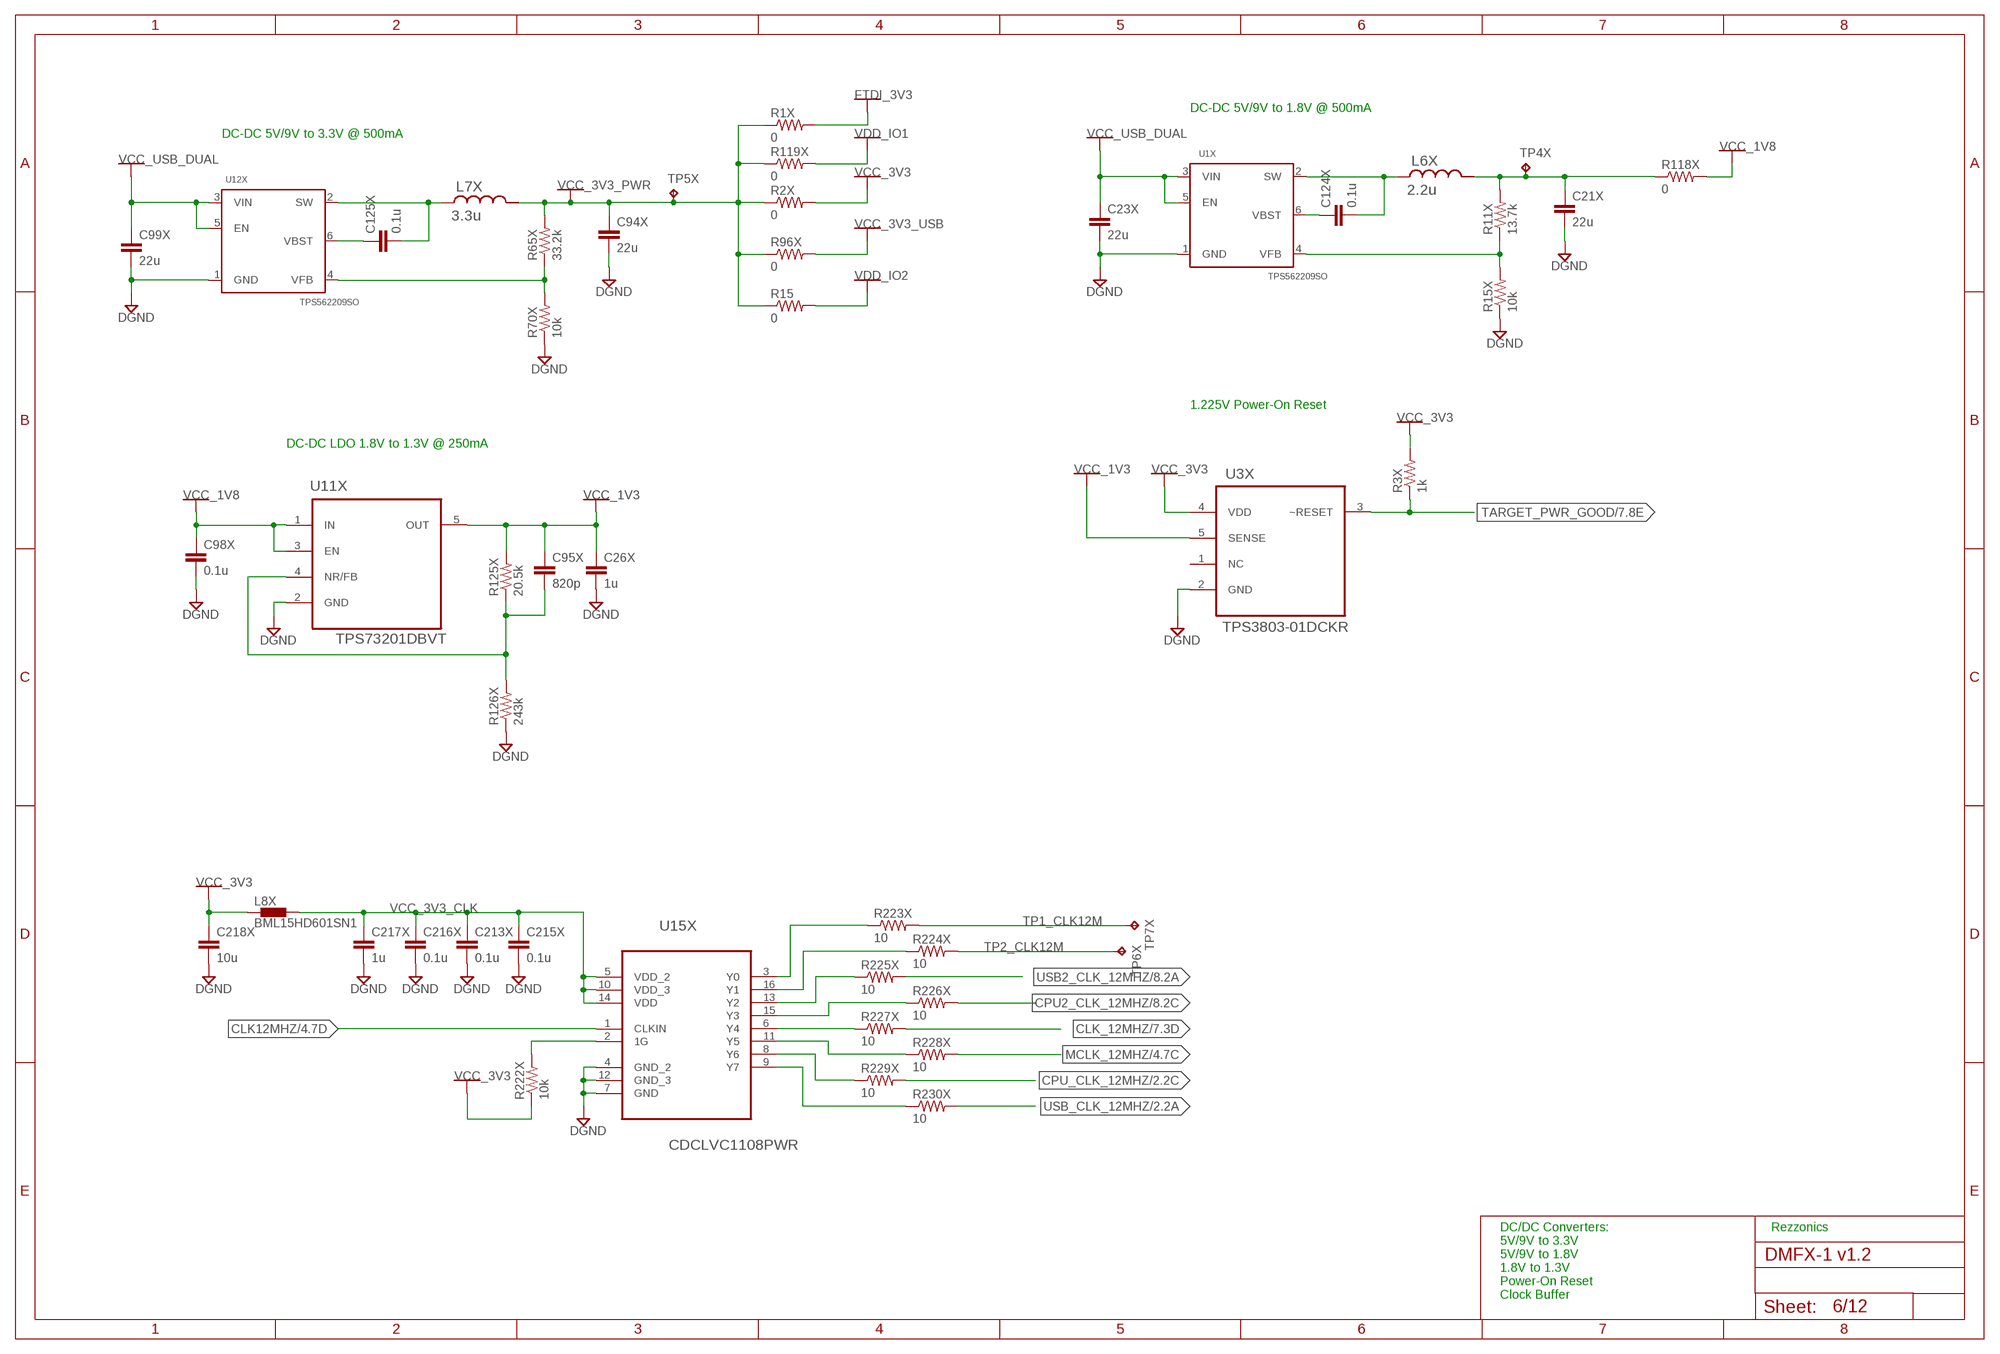
[diagram p5: schematic, sheet 6]

### Parts
C21X  22u  C-EUC1206K  [C1206K]
C23X  22u  C-EUC1210K  [C1210K]
C26X  1u  C-EUC0402K  [C0402K]
C94X  22u  C-EUC1206K  [C1206K]
C95X  820p  C-EUC0402K  [C0402K]
C98X  0.1u  C-EUC0402K  [C0402K]
C99X  22u  C-EUC1210K  [C1210K]
C124X  0.1u  C-EUC0402K  [C0402K]
C125X  0.1u  C-EUC0402K  [C0402K]
C213X  0.1u  C-EUC0402K  [C0402K]
C215X  0.1u  C-EUC0402K  [C0402K]
C216X  0.1u  C-EUC0402K  [C0402K]
C217X  1u  C-EUC0402K  [C0402K]
C218X  10u  C-EUC0603K  [C0603K]
L6X  2.2u  SRN3015  [SRN3015]
L7X  3.3u  SRN3015  [SRN3015]
L8X  BML15HD601SN1  [0402]
R1X  0  RESISTOR0402-RES  [0402-RES]
R2X  0  RESISTOR0402-RES  [0402-RES]
R3X  1k  RESISTOR0402-RES  [0402-RES]
R11X  13.7k  RESISTOR0402-RES  [0402-RES]
R15  0  RESISTOR0402-RES  [0402-RES]
R15X  10k  RESISTOR0402-RES  [0402-RES]
R65X  33.2k  RESISTOR0402-RES  [0402-RES]
R70X  10k  RESISTOR0402-RES  [0402-RES]
R96X  0  RESISTOR0402-RES  [0402-RES]
R118X  0  RESISTOR0402-RES  [0402-RES]
R119X  0  RESISTOR0402-RES  [0402-RES]
R125X  20.5k  RESISTOR0402-RES  [0402-RES]
R126X  243k  RESISTOR0402-RES  [0402-RES]
R222X  10k  RESISTOR0402-RES  [0402-RES]
R223X  10  RESISTOR0402-RES  [0402-RES]
R224X  10  RESISTOR0402-RES  [0402-RES]
R225X  10  RESISTOR0402-RES  [0402-RES]
R226X  10  RESISTOR0402-RES  [0402-RES]
R227X  10  RESISTOR0402-RES  [0402-RES]
R228X  10  RESISTOR0402-RES  [0402-RES]
R229X  10  RESISTOR0402-RES  [0402-RES]
R230X  10  RESISTOR0402-RES  [0402-RES]
TP4X  TPTP06R  [TP06R]
TP5X  TPTP06R  [TP06R]
TP6X  TPTP06R  [TP06R]
TP7X  TPTP06R  [TP06R]
U1X  TPS562209SO  [SOT95P280X145-6N]
U3X  TPS3803-01DCKR  [SOT65P210X110-5N]
U11X  TPS73201DBVT  [SOT95P280X145-5N]
U12X  TPS562209SO  [SOT95P280X145-6N]
U15X  CDCLVC1108PWR  [SOP65P640X120-16N]

### Nets
CLK12MHZ: U15X.1(CLKIN) ; also sheet 4
CLK_12MHZ: R227X.2 ; also sheet 7
CPU2_CLK_12MHZ: R226X.2 ; also sheet 8
CPU_CLK_12MHZ: R229X.2 ; also sheet 2
DGND [POWER]: C21X.2 C23X.2 C26X.2 C94X.2 C98X.2 C99X.2 C213X.2 C215X.2 C216X.2 C217X.2 C218X.2 R15X.1 R70X.1 R126X.1 U1X.1(GND) U3X.2(GND) U11X.2(GND) U12X.1(GND) U15X.4(GND_2) U15X.7(GND) U15X.12(GND_3) ; also sheet 2,3,4,5,7,8,9,10,11,12
FTDI_3V3: R1X.2 ; also sheet 7
MCLK_12MHZ: R228X.2 ; also sheet 4
N$31: C95X.2 R125X.1 R126X.2 U11X.4(NR/FB)
N$33: C125X.1 U12X.6(VBST)
N$34: C125X.2 L7X.2 U12X.2(SW)
N$44: R65X.1 R70X.2 U12X.4(VFB)
N$47: C124X.1 U1X.6(VBST)
N$48: C124X.2 L6X.2 U1X.2(SW)
N$49: C21X.1 L6X.1 R11X.2 R118X.1 TP4X.TP
N$51: R11X.1 R15X.2 U1X.4(VFB)
N$110: R223X.1 U15X.3(Y0)
N$169: R224X.1 U15X.16(Y1)
N$173: R225X.1 U15X.13(Y2)
N$174: R222X.2 U15X.2(1G)
N$179: R226X.1 U15X.15(Y3)
N$180: R227X.1 U15X.6(Y4)
N$181: R228X.1 U15X.11(Y5)
N$182: R229X.1 U15X.8(Y6)
N$183: R230X.1 U15X.9(Y7)
TARGET_PWR_GOOD: R3X.1 U3X.3(~RESET) ; also sheet 2,4,7,8,10
TP1_CLK12M: R223X.2 TP7X.TP
TP2_CLK12M: R224X.2 TP6X.TP
USB2_CLK_12MHZ: R225X.2 ; also sheet 8
USB_CLK_12MHZ: R230X.2 ; also sheet 2
VCC_1V3: C26X.1 C95X.1 R125X.2 U3X.5(SENSE) U11X.5(OUT) ; also sheet 2,3,8,9
VCC_1V8: C98X.1 R118X.2 U11X.1(IN) U11X.3(EN) ; also sheet 3,4,9
VCC_3V3 [POWER]: C218X.1 L8X.1 R2X.2 R3X.2 R222X.1 U3X.4(VDD) ; also sheet 4,5,10
VCC_3V3_CLK: C213X.1 C215X.1 C216X.1 C217X.1 L8X.2 U15X.5(VDD_2) U15X.10(VDD_3) U15X.14(VDD)
VCC_3V3_PWR: C94X.1 L7X.1 R1X.1 R2X.1 R15.1 R65X.2 R96X.1 R119X.1 TP5X.TP ; also sheet 3,9
VCC_3V3_USB [POWER]: R96X.2 ; also sheet 2,3,8,9
VCC_USB_DUAL [POWER]: C23X.1 C99X.1 U1X.3(VIN) U1X.5(EN) U12X.3(VIN) U12X.5(EN) ; also sheet 7
VDD_IO1: R119X.2 ; also sheet 2,5
VDD_IO2: R15.2 ; also sheet 5,8
Unconnected: U3X.1(NC)

### Notes on the sheet
- DC-DC 5V/9V to 1.8V @ 500mA
- DC-DC 5V/9V to 3.3V @ 500mA
- 1.225V Power-On Reset
- DC-DC LDO 1.8V to 1.3V @ 250mA
- DC/DC Converters:
  5V/9V to 3.3V
  5V/9V to 1.8V
  1.8V to 1.3V
  Power-On Reset
  Clock Buffer
- Rezzonics

## Sheet 7 of 12
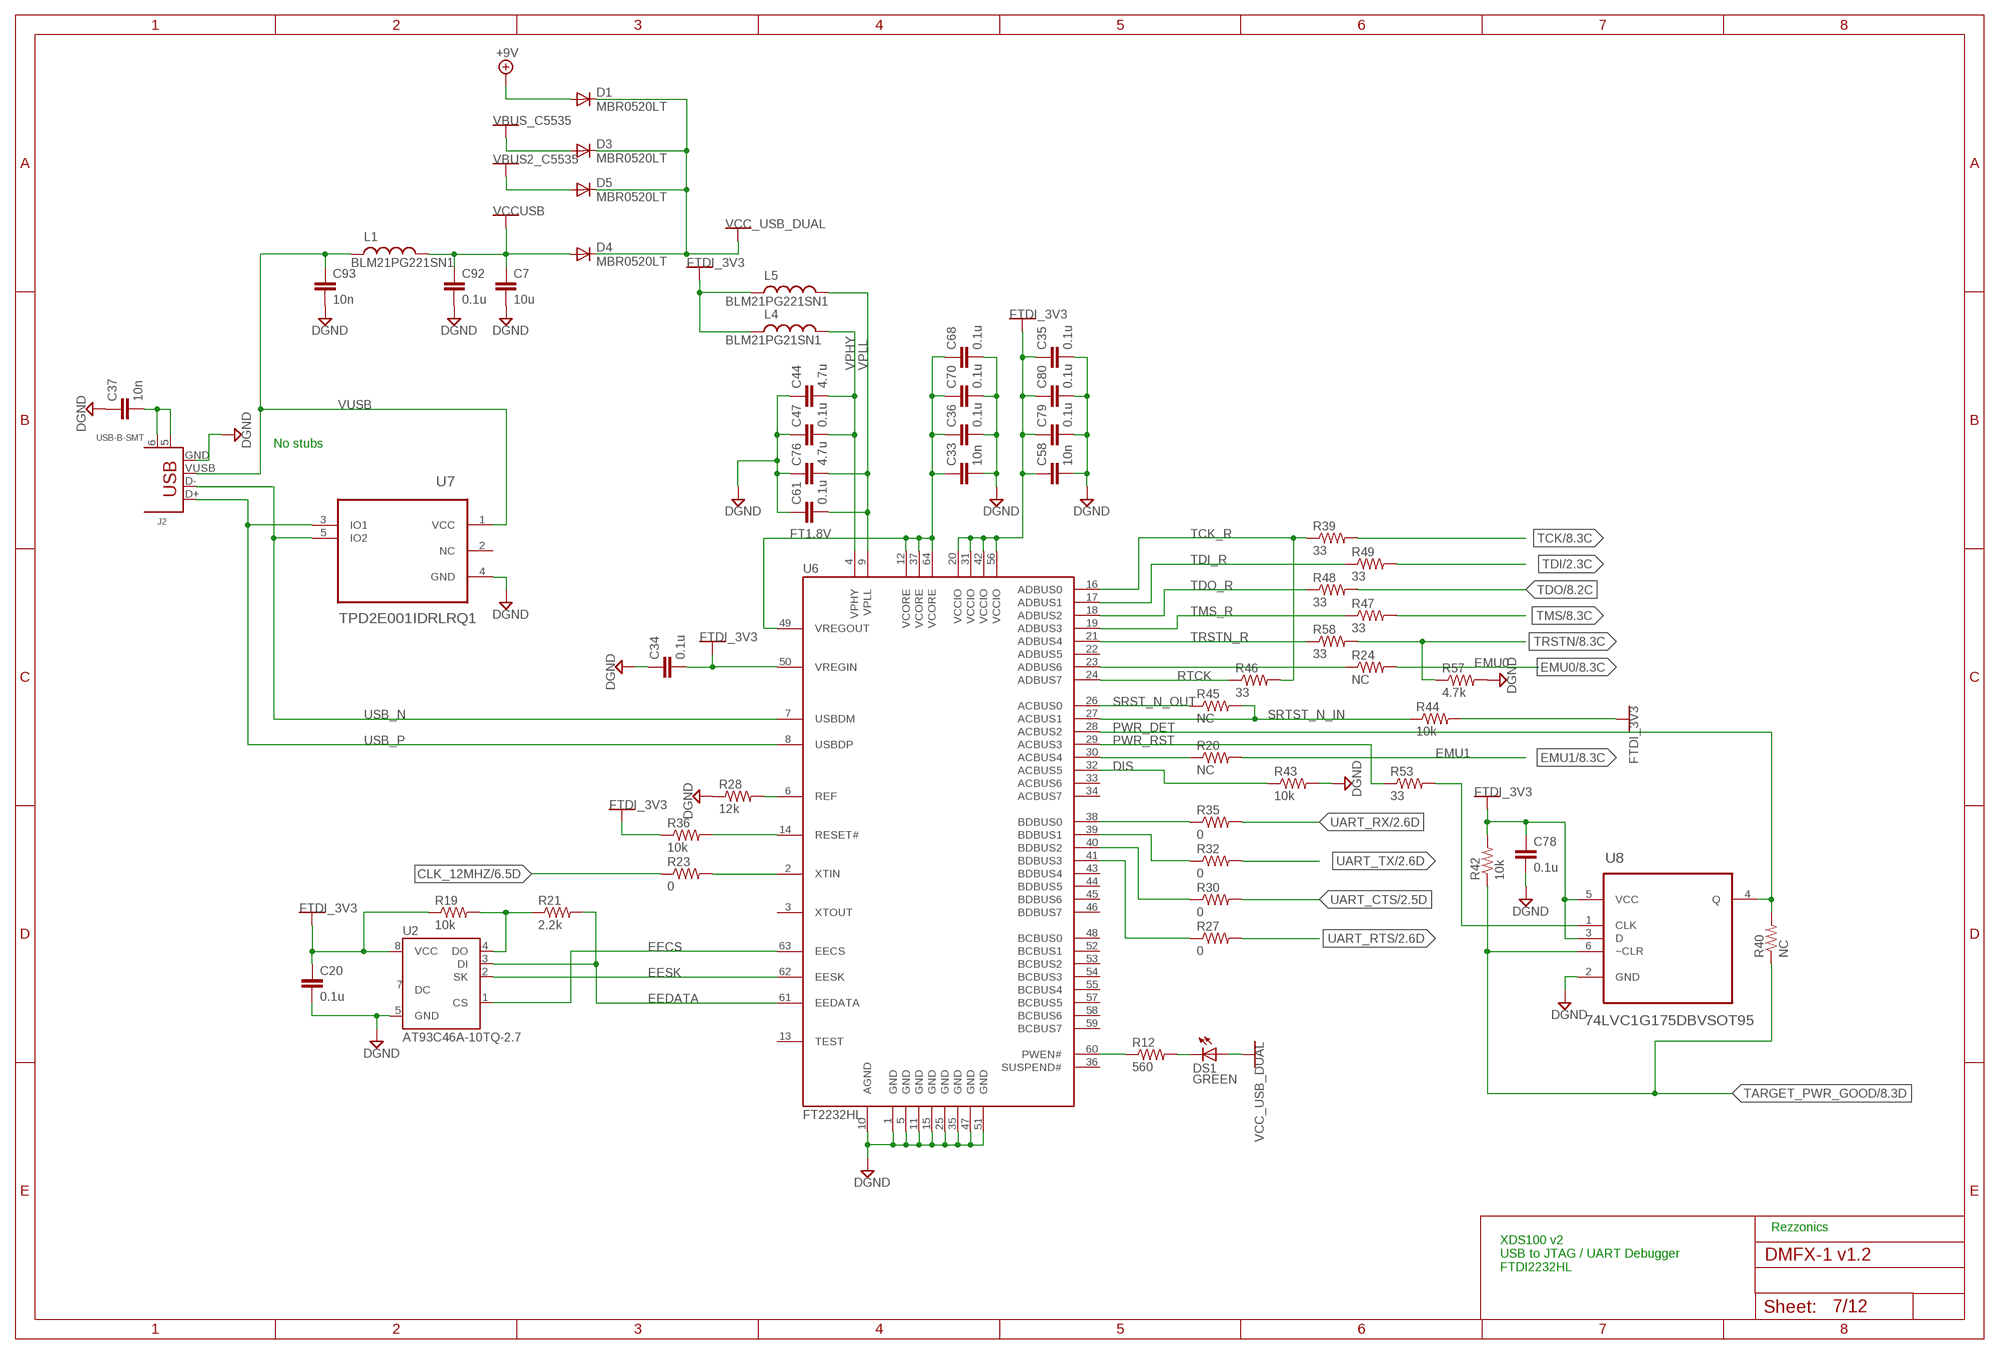
[diagram p6: schematic, sheet 7]

### Parts
C7  10u  C-EUC0603K  [C0603K]
C20  0.1u  C-EUC0402K  [C0402K]
C33  10n  C-EUC0402K  [C0402K]
C34  0.1u  C-EUC0402K  [C0402K]
C35  0.1u  C-EUC0402K  [C0402K]
C36  0.1u  C-EUC0402K  [C0402K]
C37  10n  C-EUC0402K  [C0402K]
C44  4.7u  C-EUC0603K  [C0603K]
C47  0.1u  C-EUC0402K  [C0402K]
C58  10n  C-EUC0402K  [C0402K]
C61  0.1u  C-EUC0402K  [C0402K]
C68  0.1u  C-EUC0402K  [C0402K]
C70  0.1u  C-EUC0402K  [C0402K]
C76  4.7u  C-EUC0603K  [C0603K]
C78  0.1u  C-EUC0402K  [C0402K]
C79  0.1u  C-EUC0402K  [C0402K]
C80  0.1u  C-EUC0402K  [C0402K]
C92  0.1u  C-EUC0402K  [C0402K]
C93  10n  C-EUC0402K  [C0402K]
D1  MBR0520LT  [SOD123]
D3  MBR0520LT  [SOD123]
D4  MBR0520LT  [SOD123]
D5  MBR0520LT  [SOD123]
DS1  GREEN  LEDCHIPLED_1206  [CHIPLED_1206]
J2  USB-B-SMT  [USB-B-SMT]
L1  BLM21PG221SN1  INDUCTOR0805  [0805]
L4  BLM21PG21SN1  INDUCTOR0805  [0805]
L5  BLM21PG221SN1  INDUCTOR0805  [0805]
R12  560  RESISTOR0402-RES  [0402-RES]
R19  10k  RESISTOR0402-RES  [0402-RES]
R20  NC  RESISTOR0402-RES  [0402-RES]
R21  2.2k  RESISTOR0402-RES  [0402-RES]
R23  0  RESISTOR0402-RES  [0402-RES]
R24  NC  RESISTOR0402-RES  [0402-RES]
R27  0  RESISTOR0402-RES  [0402-RES]
R28  12k  RESISTOR0402-RES  [0402-RES]
R30  0  RESISTOR0402-RES  [0402-RES]
R32  0  RESISTOR0402-RES  [0402-RES]
R35  0  RESISTOR0402-RES  [0402-RES]
R36  10k  RESISTOR0402-RES  [0402-RES]
R39  33  RESISTOR0402-RES  [0402-RES]
R40  NC  RESISTOR0402-RES  [0402-RES]
R42  10k  RESISTOR0402-RES  [0402-RES]
R43  10k  RESISTOR0402-RES  [0402-RES]
R44  10k  RESISTOR0402-RES  [0402-RES]
R45  NC  RESISTOR0402-RES  [0402-RES]
R46  33  RESISTOR0402-RES  [0402-RES]
R47  33  RESISTOR0402-RES  [0402-RES]
R48  33  RESISTOR0402-RES  [0402-RES]
R49  33  RESISTOR0402-RES  [0402-RES]
R53  33  RESISTOR0402-RES  [0402-RES]
R57  4.7k  RESISTOR0402-RES  [0402-RES]
R58  33  RESISTOR0402-RES  [0402-RES]
U2  AT93C46A-10TQ-2.7  [TSSOP8]
U6  FT2232HL  FT2232H  [LQFP-10X10-64]
U7  TPD2E001IDRLRQ1  [SOT50P160X60-5N]
U8  74LVC1G175DBVSOT95  [SOT95P280X145-6N]

### Nets
CLK_12MHZ: R23.1 ; also sheet 6
DGND [POWER]: C7.2 C20.2 C33.2 C34.1 C35.2 C36.2 C37.1 C44.1 C47.1 C58.2 C61.1 C68.2 C70.2 C76.1 C78.2 C79.2 C80.2 C92.2 C93.2 J2.GND R28.1 R43.2 R57.2 U2.5(GND) U6.1(GND) U6.5(GND) U6.10(AGND) U6.11(GND) U6.15(GND) U6.25(GND) U6.35(GND) U6.47(GND) U6.51(GND) U7.4(GND) U8.2(GND) ; also sheet 2,3,4,5,6,8,9,10,11,12
DIS: R43.1 U6.32(ACBUS5)
EECS: U2.1(CS) U6.63(EECS)
EEDATA: R21.2 U2.3(DI) U6.61(EEDATA)
EESK: U2.2(SK) U6.62(EESK)
EMU0: R24.2 ; also sheet 2,8
EMU1: R20.2 ; also sheet 2,8
FT1.8V: C33.1 C36.1 C68.1 C70.1 U6.12(VCORE) U6.37(VCORE) U6.49(VREGOUT) U6.64(VCORE)
FTDI_3V3: C20.1 C34.2 C35.1 C58.1 C78.1 C79.1 C80.1 L4.1 L5.1 R19.1 R36.1 R42.2 R44.2 U2.8(VCC) U6.20(VCCIO) U6.31(VCCIO) U6.42(VCCIO) U6.50(VREGIN) U6.56(VCCIO) U8.3(D) U8.5(VCC) ; also sheet 6
N$9: R20.1 U6.30(ACBUS4)
N$10: R24.1 U6.23(ADBUS6)
N$35: R36.2 U6.14(RESET#)
N$40: R23.2 U6.2(XTIN)
N$52: R28.2 U6.6(REF)
N$53: R19.2 R21.1 U2.4(DO)
N$55: DS1.C R12.2
N$56: R12.1 U6.60(PWEN#)
N$57: C37.2 J2.5 J2.6
N$58: R53.2 U8.1(CLK)
N$59: R35.1 U6.38(BDBUS0)
N$60: R32.1 U6.39(BDBUS1)
N$61: R30.1 U6.40(BDBUS2)
N$62: R27.1 U6.41(BDBUS3)
PWR_DET: R40.2 U6.28(ACBUS2) U8.4(Q)
PWR_RST: R53.1 U6.29(ACBUS3)
RTCK: R46.1 U6.24(ADBUS7)
SRST_N_OUT: R45.1 U6.26(ACBUS0)
SRTST_N_IN: R44.1 R45.2 U6.27(ACBUS1)
TARGET_PWR_GOOD: R40.1 R42.1 U8.6(~CLR) ; also sheet 2,4,6,8,10
TCK: R39.2 ; also sheet 2,8
TCK_R: R39.1 R46.2 U6.16(ADBUS0)
TDI: R49.2 ; also sheet 2
TDI_R: R49.1 U6.17(ADBUS1)
TDO: R48.2 ; also sheet 8
TDO_R: R48.1 U6.18(ADBUS2)
TMS: R47.2 ; also sheet 2,8
TMS_R: R47.1 U6.19(ADBUS3)
TRSTN: R57.1 R58.2 ; also sheet 2,8
TRSTN_R: R58.1 U6.21(ADBUS4)
UART_CTS: R30.2 ; also sheet 2
UART_RTS: R27.2 ; also sheet 2
UART_RX: R35.2 ; also sheet 2
UART_TX: R32.2 ; also sheet 2
USB_N: J2.D- U6.7(USBDM) U7.5(IO2)
USB_P: J2.D+ U6.8(USBDP) U7.3(IO1)
V3.3AA [POWER]: D1.A ; supply symbol labelled +9V ; also sheet 11
VBUS2_C5535 [POWER]: D5.A ; also sheet 8
VBUS_C5535 [POWER]: D3.A ; also sheet 2
VCC_USB_DUAL [POWER]: D1.C D3.C D4.C D5.C DS1.A ; also sheet 6
VCCUSB: C7.1 C92.1 D4.A L1.2
VPHY: C44.2 C47.2 L4.2 U6.4(VPHY)
VPLL: C61.2 C76.2 L5.2 U6.9(VPLL)
VUSB: C93.1 J2.VUSB(VBUS) L1.1 U7.1(VCC)
Unconnected: U2.6(NC) U2.7(DC) U6.3(XTOUT) U6.13(TEST) U6.22(ADBUS5) U6.33(ACBUS6) U6.34(ACBUS7) U6.36(SUSPEND#) U6.43(BDBUS4) U6.44(BDBUS5) U6.45(BDBUS6) U6.46(BDBUS7) U6.48(BCBUS0) U6.52(BCBUS1) U6.53(BCBUS2) U6.54(BCBUS3) U6.55(BCBUS4) U6.57(BCBUS5) U6.58(BCBUS6) U6.59(BCBUS7) U7.2(NC)

### Notes on the sheet
- No stubs
- Rezzonics
- XDS100 v2
  USB to JTAG / UART Debugger
  FTDI2232HL

## Sheet 8 of 12
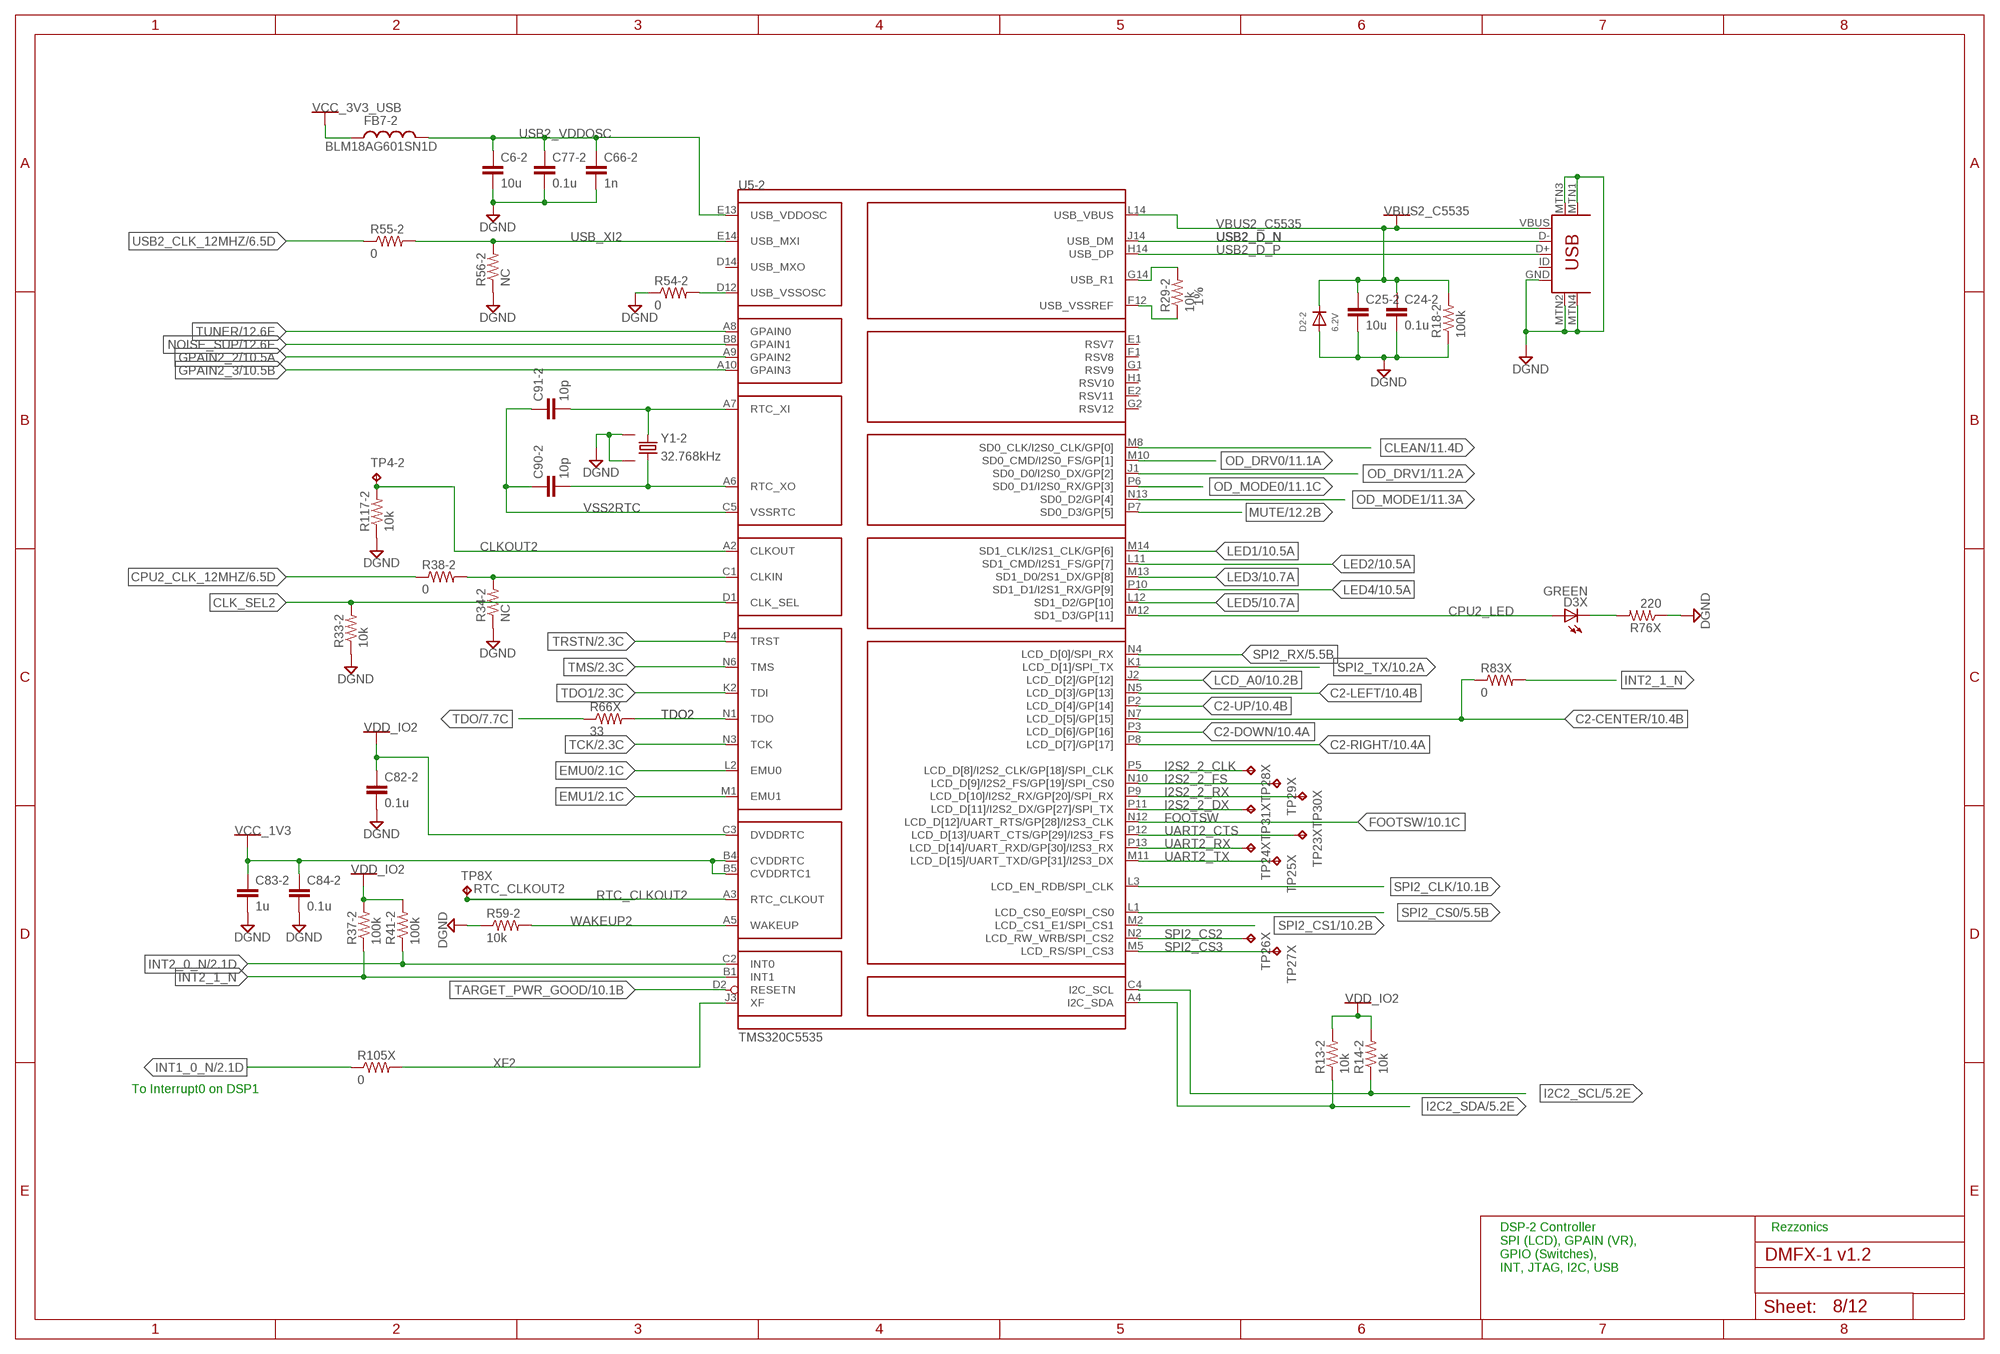
[diagram p7: schematic, sheet 8]

### Parts
C6-2  10u  C-EUC0603K  [C0603K]
C24-2  0.1u  C-EUC0402K  [C0402K]
C25-2  10u  C-EUC0603K  [C0603K]
C66-2  1n  C0402_BGA  [0402]
C77-2  0.1u  C-EUC0402K  [C0402K]
C82-2  0.1u  C0402_BGA  [0402]
C83-2  1u  C0402_BGA  [0402]
C84-2  0.1u  C0402_BGA  [0402]
C90-2  10p  C-EUC0402K  [C0402K]
C91-2  10p  C-EUC0402K  [C0402K]
D2-2  6.2V  DIODESMA  [SMADIODE]
D3X  GREEN  LEDCHIPLED_0603  [CHIPLED_0603]
FB7-2  BLM18AG601SN1D  INDUCTOR0805  [0805]
J1-2  USB-MINIB-5PIN  [USB-MINIB]
R13-2  10k  RESISTOR0402-RES  [0402-RES]
R14-2  10k  RESISTOR0402-RES  [0402-RES]
R18-2  100k  RESISTOR0402-RES  [0402-RES]
R29-2  10k  CRCW04021K00FKED  [0402]
R33-2  10k  RESISTOR0402-RES  [0402-RES]
R34-2  NC  CRCW04021K00FKED  [0402]
R37-2  100k  RESISTOR0402-RES  [0402-RES]
R38-2  0  CRCW04021K00FKED  [0402]
R41-2  100k  RESISTOR0402-RES  [0402-RES]
R54-2  0  CRCW04021K00FKED  [0402]
R55-2  0  RESISTOR0402-RES  [0402-RES]
R56-2  NC  RESISTOR0402-RES  [0402-RES]
R59-2  10k  RESISTOR0402-RES  [0402-RES]
R66X  33  RESISTOR0402-RES  [0402-RES]
R76X  220  RESISTOR0402-RES  [0402-RES]
R83X  0  CRCW04021K00FKED  [0402]
R105X  0  RESISTOR0402-RES  [0402-RES]
R117-2  10k  RESISTOR0402-RES  [0402-RES]
TP4-2  TPTP06R  [TP06R]
TP8X  TPTP06R  [TP06R]
TP23X  TPTP06R  [TP06R]
TP24X  TPTP06R  [TP06R]
TP25X  TPTP06R  [TP06R]
TP26X  TPTP06R  [TP06R]
TP27X  TPTP06R  [TP06R]
TP28X  TPTP06R  [TP06R]
TP29X  TPTP06R  [TP06R]
TP30X  TPTP06R  [TP06R]
TP31X  TPTP06R  [TP06R]
U5  TMS320C5535  TMS320C5535S-PBGA-N144  [PBGA144]
Y1-2  32.768kHz  CRYSTAL  [CRYSTAL-32KHZ-SMD_EPSON_MC146]

### Nets
C2-CENTER: R83X.1 U5.N7(-2:LCD_D[5]/GP[15]) ; also sheet 10
C2-DOWN: U5.P3(-2:LCD_D[6]/GP[16]) ; also sheet 10
C2-LEFT: U5.N5(-2:LCD_D[3]/GP[13]) ; also sheet 10
C2-RIGHT: U5.P8(-2:LCD_D[7]/GP[17]) ; also sheet 10
C2-UP: U5.P2(-2:LCD_D[4]/GP[14]) ; also sheet 10
CLEAN: U5.M8(-2:SD0_CLK/I2S0_CLK/GP[0]) ; also sheet 11
CLK_SEL2: R33-2.2 U5.D1(-2:CLK_SEL)
CLKOUT2: R117-2.2 TP4-2.TP U5.A2(-2:CLKOUT)
CPU2_CLK_12MHZ: R38-2.1 ; also sheet 6
CPU2_LED: D3X.A U5.M12(-2:SD1_D3/GP[11])
DGND [POWER]: C6-2.2 C24-2.2 C25-2.2 C66-2.2 C77-2.2 C82-2.2 C83-2.2 C84-2.2 D2-2.A J1-2.GND J1-2.MTN1(MTN2) J1-2.MTN2(MTN3) J1-2.MTN3(MTN1) J1-2.MTN4 R18-2.1 R33-2.1 R34-2.1 R54-2.1 R56-2.1 R59-2.1 R76X.1 R117-2.1 Y1-2.NC1 Y1-2.NC2 ; also sheet 2,3,4,5,6,7,9,10,11,12
EMU0: U5.L2(-2:EMU0) ; also sheet 2,7
EMU1: U5.M1(-2:EMU1) ; also sheet 2,7
FOOTSW: U5.N12(-2:LCD_D[12]/UART_RTS/GP[28]/I2S3_CLK) ; also sheet 10
GPAIN2_2: U5.A9(-2:GPAIN2) ; also sheet 10
GPAIN2_3: U5.A10(-2:GPAIN3) ; also sheet 10
I2C2_SCL: R14-2.1 U5.C4(-2:I2C_SCL) ; also sheet 5
I2C2_SDA: R13-2.1 U5.A4(-2:I2C_SDA) ; also sheet 5
I2S2_2_CLK: TP28X.TP U5.P5(-2:LCD_D[8]/I2S2_CLK/GP[18]/SPI_CLK)
I2S2_2_DX: TP31X.TP U5.P11(-2:LCD_D[11]/I2S2_DX/GP[27]/SPI_TX)
I2S2_2_FS: TP29X.TP U5.N10(-2:LCD_D[9]/I2S2_FS/GP[19]/SPI_CS0)
I2S2_2_RX: TP30X.TP U5.P9(-2:LCD_D[10]/I2S2_RX/GP[20]/SPI_RX)
INT1_0_N: R105X.1 ; also sheet 2
INT2_0_N: R41-2.1 U5.C2(-2:INT0) ; also sheet 2
INT2_1_N: R37-2.1 R83X.2 U5.B1(-2:INT1)
LCD_A0: U5.J2(-2:LCD_D[2]/GP[12]) ; also sheet 10
LED1: U5.M14(-2:SD1_CLK/I2S1_CLK/GP[6]) ; also sheet 10
LED2: U5.L11(-2:SD1_CMD/I2S1_FS/GP[7]) ; also sheet 10
LED3: U5.M13(-2:SD1_D0/2S1_DX/GP[8]) ; also sheet 10
LED4: U5.P10(-2:SD1_D1/I2S1_RX/GP[9]) ; also sheet 10
LED5: U5.L12(-2:SD1_D2/GP[10]) ; also sheet 10
MUTE: U5.P7(-2:SD0_D3/GP[5]) ; also sheet 12
N$69: C91-2.2 U5.A7(-2:RTC_XI) Y1-2.P$2
N$70: C90-2.2 U5.A6(-2:RTC_XO) Y1-2.P$1
N$73: R34-2.2 R38-2.2 U5.C1(-2:CLKIN)
N$75: D3X.C R76X.2
N$76: R29-2.2 U5.G14(-2:USB_R1)
NOISE_SUP: U5.B8(-2:GPAIN1) ; also sheet 12
OD_DRV0: U5.M10(-2:SD0_CMD/I2S0_FS/GP[1]) ; also sheet 11
OD_DRV1: U5.J1(-2:SD0_D0/I2S0_DX/GP[2]) ; also sheet 11
OD_MODE0: U5.P6(-2:SD0_D1/I2S0_RX/GP[3]) ; also sheet 11
OD_MODE1: U5.N13(-2:SD0_D2/GP[4]) ; also sheet 11
RTC_CLKOUT2: TP8X.TP U5.A3(-2:RTC_CLKOUT)
SPI2_CLK: U5.L3(-2:LCD_EN_RDB/SPI_CLK) ; also sheet 5,10
SPI2_CS0: U5.L1(-2:LCD_CS0_E0/SPI_CS0) ; also sheet 5
SPI2_CS1: U5.M2(-2:LCD_CS1_E1/SPI_CS1) ; also sheet 10
SPI2_CS2: TP26X.TP U5.N2(-2:LCD_RW_WRB/SPI_CS2)
SPI2_CS3: TP27X.TP U5.M5(-2:LCD_RS/SPI_CS3)
SPI2_RX: U5.N4(-2:LCD_D[0]/SPI_RX) ; also sheet 5
SPI2_TX: U5.K1(-2:LCD_D[1]/SPI_TX) ; also sheet 5,10
TARGET_PWR_GOOD: U5.D2(-2:RESETN) ; also sheet 2,4,6,7,10
TCK: U5.N3(-2:TCK) ; also sheet 2,7
TDO: R66X.1 ; also sheet 7
TDO1: U5.K2(-2:TDI) ; also sheet 2
TDO2: R66X.2 U5.N1(-2:TDO)
TMS: U5.N6(-2:TMS) ; also sheet 2,7
TRSTN: U5.P4(-2:TRST) ; also sheet 2,7
TUNER: U5.A8(-2:GPAIN0) ; also sheet 12
UART2_CTS: TP23X.TP U5.P12(-2:LCD_D[13]/UART_CTS/GP[29]/I2S3_FS)
UART2_RX: TP24X.TP U5.P13(-2:LCD_D[14]/UART_RXD/GP[30]/I2S3_RX)
UART2_TX: TP25X.TP U5.M11(-2:LCD_D[15]/UART_TXD/GP[31]/I2S3_DX)
USB2_CLK_12MHZ: R55-2.1 ; also sheet 6
USB2_D_N: J1-2.D- U5.J14(-2:USB_DM)
USB2_D_P: J1-2.D+ U5.H14(-2:USB_DP)
USB2_VDDOSC [POWER]: C6-2.1 C66-2.1 C77-2.1 FB7-2.2 U5.E13(-2:USB_VDDOSC)
USB2_VSSOSC: R54-2.2 U5.D12(-2:USB_VSSOSC)
USB2_VSSREF: R29-2.1 U5.F12(-2:USB_VSSREF)
USB_XI2: R55-2.2 R56-2.2 U5.E14(-2:USB_MXI)
VBUS2_C5535 [POWER]: C24-2.1 C25-2.1 D2-2.C J1-2.VBUS R18-2.2 U5.L14(-2:USB_VBUS) ; also sheet 7
VCC_1V3: C83-2.1 C84-2.1 U5.B4(-2:CVDDRTC) U5.B5(-2:CVDDRTC1) ; also sheet 2,3,6,9
VCC_3V3_USB [POWER]: FB7-2.1 ; also sheet 2,3,6,9
VDD_IO2: C82-2.1 R13-2.2 R14-2.2 R37-2.2 R41-2.2 U5.C3(-2:DVDDRTC) ; also sheet 5,6
VSS2RTC: C90-2.1 C91-2.1 U5.C5(-2:VSSRTC)
WAKEUP2: R59-2.2 U5.A5(-2:WAKEUP)
XF2: R105X.2 U5.J3(-2:XF)
Unconnected: J1-2.ID U5.D14(-2:USB_MXO) U5.E1(-2:RSV7) U5.E2(-2:RSV11) U5.F1(-2:RSV8) U5.G1(-2:RSV9) U5.G2(-2:RSV12) U5.H1(-2:RSV10)

### Notes on the sheet
- To Interrupt0 on DSP1
- DSP-2 Controller
  SPI (LCD), GPAIN (VR), 
  GPIO (Switches),
  INT, JTAG, I2C, USB
- Rezzonics

## Sheet 9 of 12
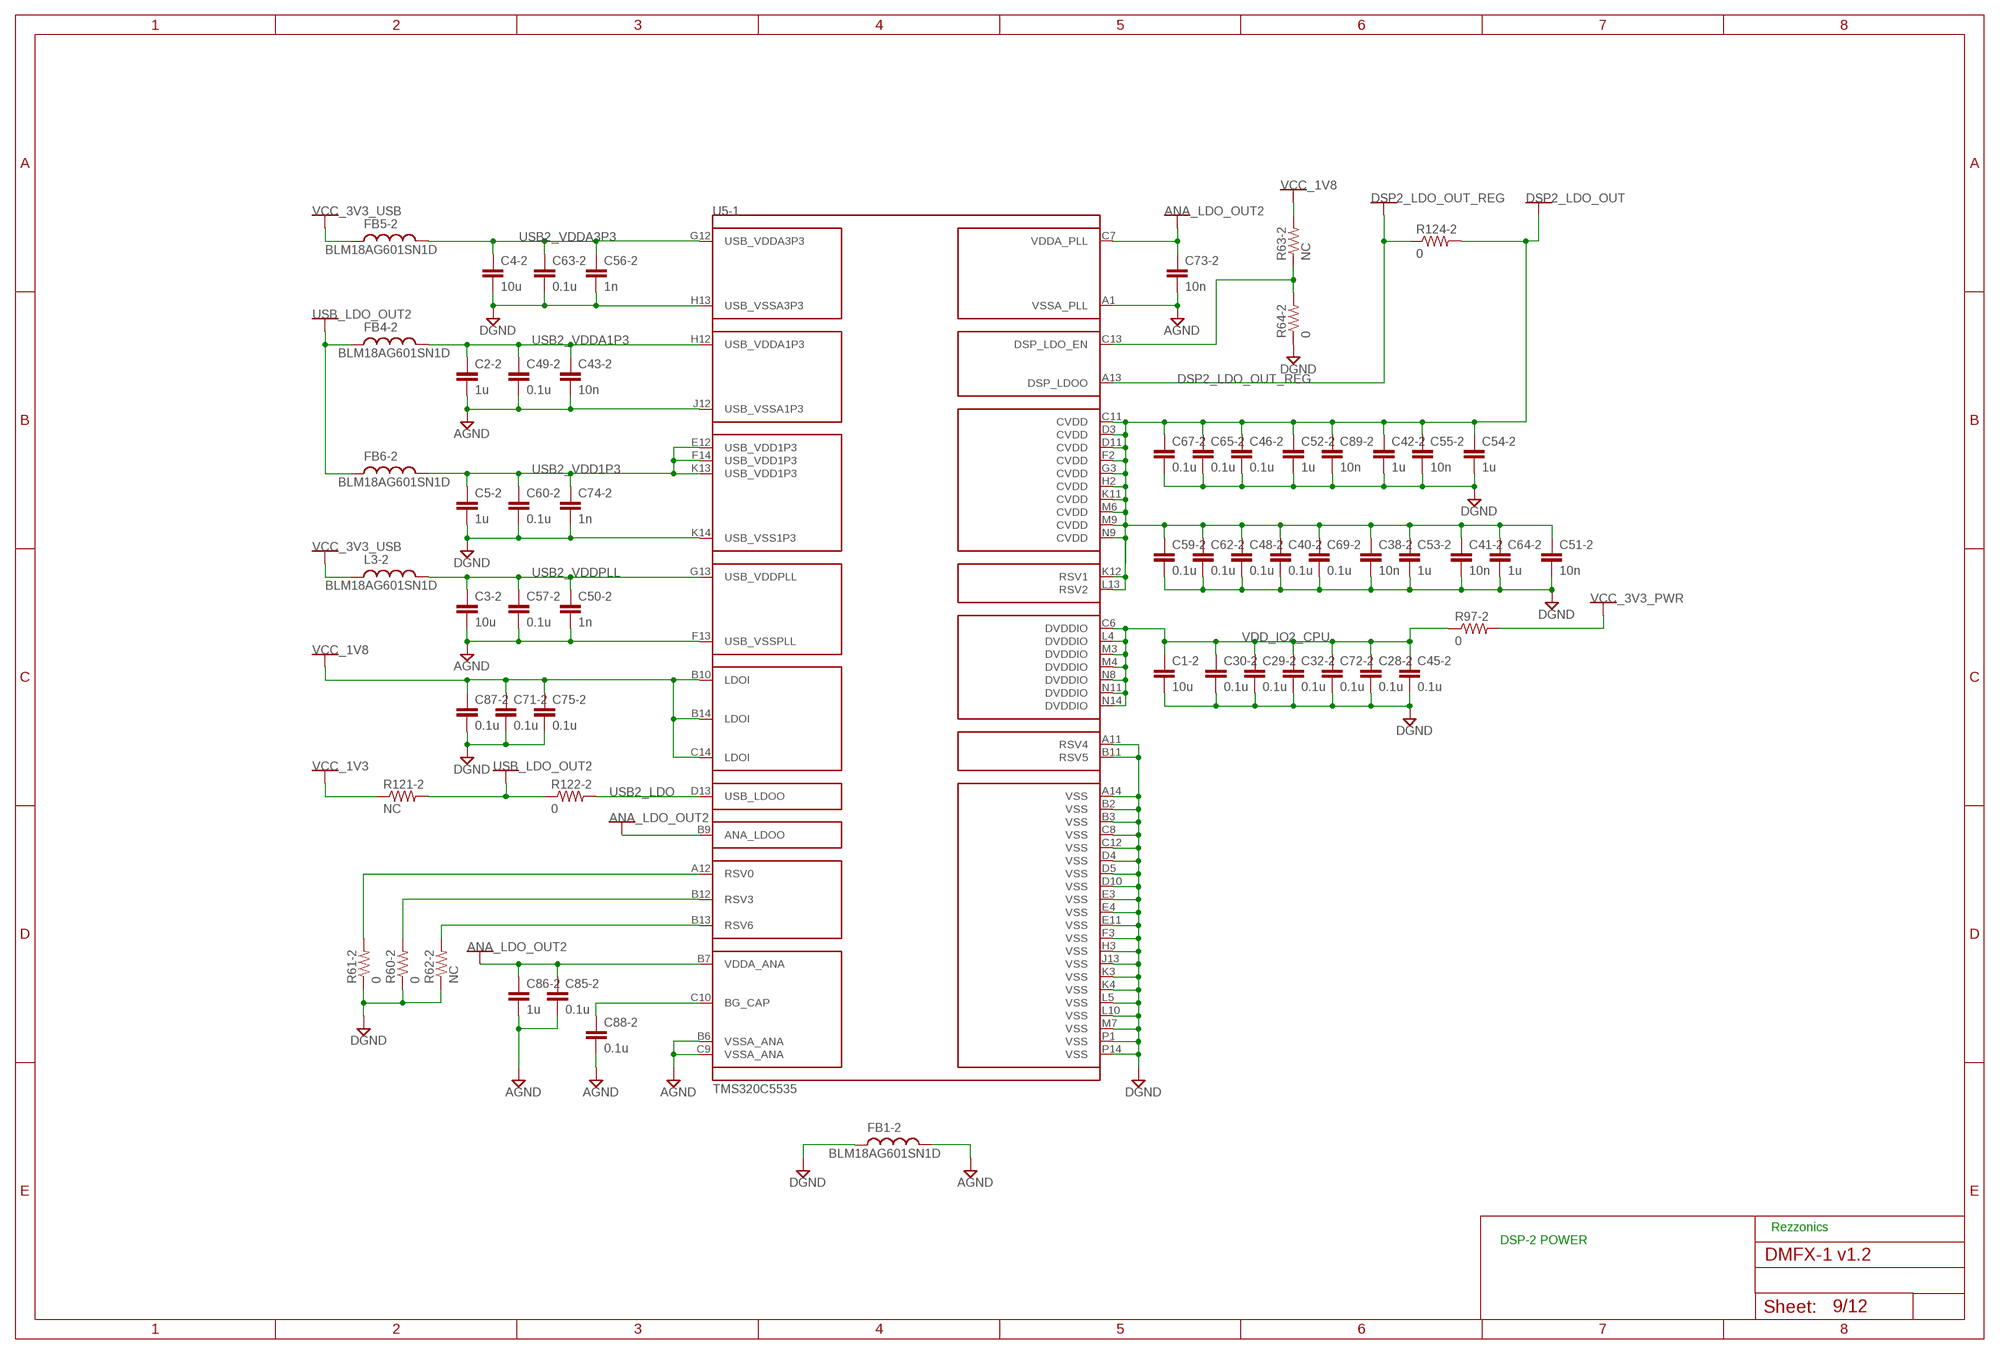
[diagram p8: schematic, sheet 9]

### Parts
C1-2  10u  C-EUC0603K  [C0603K]
C2-2  1u  C-EUC0402K  [C0402K]
C3-2  10u  C-EUC0603K  [C0603K]
C4-2  10u  C-EUC0603K  [C0603K]
C5-2  1u  C-EUC0402K  [C0402K]
C28-2  0.1u  C0402_BGA  [0402]
C29-2  0.1u  C0402_BGA  [0402]
C30-2  0.1u  C0402_BGA  [0402]
C32-2  0.1u  C0402_BGA  [0402]
C38-2  10n  C0402_BGA  [0402]
C40-2  0.1u  C0402_BGA  [0402]
C41-2  10n  C0402_BGA  [0402]
C42-2  1u  C0402_BGA  [0402]
C43-2  10n  C0402_BGA  [0402]
C45-2  0.1u  C0402_BGA  [0402]
C46-2  0.1u  C0402_BGA  [0402]
C48-2  0.1u  C0402_BGA  [0402]
C49-2  0.1u  C0402_BGA  [0402]
C50-2  1n  C0402_BGA  [0402]
C51-2  10n  C0402_BGA  [0402]
C52-2  1u  C0402_BGA  [0402]
C53-2  1u  C0402_BGA  [0402]
C54-2  1u  C0402_BGA  [0402]
C55-2  10n  C0402_BGA  [0402]
C56-2  1n  C0402_BGA  [0402]
C57-2  0.1u  C0402_BGA  [0402]
C59-2  0.1u  C0402_BGA  [0402]
C60-2  0.1u  C0402_BGA  [0402]
C62-2  0.1u  C0402_BGA  [0402]
C63-2  0.1u  C0402_BGA  [0402]
C64-2  1u  C0402_BGA  [0402]
C65-2  0.1u  C0402_BGA  [0402]
C67-2  0.1u  C0402_BGA  [0402]
C69-2  0.1u  C0402_BGA  [0402]
C71-2  0.1u  C0402_BGA  [0402]
C72-2  0.1u  C0402_BGA  [0402]
C73-2  10n  C0402_BGA  [0402]
C74-2  1n  C-EUC0402K  [C0402K]
C75-2  0.1u  C0402_BGA  [0402]
C85-2  0.1u  C0402_BGA  [0402]
C86-2  1u  C0402_BGA  [0402]
C87-2  0.1u  C0402_BGA  [0402]
C88-2  0.1u  C0402_BGA  [0402]
C89-2  10n  C-EUC0402K  [C0402K]
FB1-2  BLM18AG601SN1D  INDUCTOR0603  [0603]
FB4-2  BLM18AG601SN1D  INDUCTOR0603  [0603]
FB5-2  BLM18AG601SN1D  INDUCTOR0603  [0603]
FB6-2  BLM18AG601SN1D  INDUCTOR0603  [0603]
L3-2  BLM18AG601SN1D  INDUCTOR0603  [0603]
R60-2  0  RESISTOR0402-RES  [0402-RES]
R61-2  0  RESISTOR0402-RES  [0402-RES]
R62-2  NC  RESISTOR0402-RES  [0402-RES]
R63-2  NC  RESISTOR0402-RES  [0402-RES]
R64-2  0  RESISTOR0402-RES  [0402-RES]
R97-2  0  RESISTOR0805-RES  [0805]
R121-2  NC  RESISTOR0805-RES  [0805]
R122-2  0  RESISTOR0805-RES  [0805]
R124-2  0  RESISTOR0805-RES  [0805]

### Nets
AGND [POWER]: C2-2.2 C3-2.2 C43-2.2 C49-2.2 C50-2.2 C57-2.2 C73-2.2 C85-2.2 C86-2.2 C88-2.2 FB1-2.2 U5.A1(-1:VSSA_PLL) U5.B6(-1:VSSA_ANA) U5.C9(-1:VSSA_ANA) U5.F13(-1:USB_VSSPLL) U5.J12(-1:USB_VSSA1P3) ; also sheet 3
ANA_LDO_OUT2: C73-2.1 C85-2.1 C86-2.1 U5.B7(-1:VDDA_ANA) U5.B9(-1:ANA_LDOO) U5.C7(-1:VDDA_PLL) ; also sheet 10
DGND [POWER]: C1-2.2 C4-2.2 C5-2.2 C28-2.2 C29-2.2 C30-2.2 C32-2.2 C38-2.2 C40-2.2 C41-2.2 C42-2.2 C45-2.2 C46-2.2 C48-2.2 C51-2.2 C52-2.2 C53-2.2 C54-2.2 C55-2.2 C56-2.2 C59-2.2 C60-2.2 C62-2.2 C63-2.2 C64-2.2 C65-2.2 C67-2.2 C69-2.2 C71-2.2 C72-2.2 C74-2.2 C75-2.2 C87-2.2 C89-2.2 FB1-2.1 R60-2.1 R61-2.1 R62-2.1 R64-2.1 U5.A11(-1:RSV4) U5.A14(-1:VSS) U5.B2(-1:VSS) U5.B3(-1:VSS) U5.B11(-1:RSV5) U5.C8(-1:VSS) U5.C12(-1:VSS) U5.D4(-1:VSS) U5.D5(-1:VSS) U5.D10(-1:VSS) U5.E3(-1:VSS) U5.E4(-1:VSS) U5.E11(-1:VSS) U5.F3(-1:VSS) U5.H3(-1:VSS) U5.H13(-1:USB_VSSA3P3) U5.J13(-1:VSS) U5.K3(-1:VSS) U5.K4(-1:VSS) U5.K14(-1:USB_VSS1P3) U5.L5(-1:VSS) U5.L10(-1:VSS) U5.M7(-1:VSS) U5.P1(-1:VSS) U5.P14(-1:VSS) ; also sheet 2,3,4,5,6,7,8,10,11,12
DSP2_LDO_OUT: C38-2.1 C40-2.1 C41-2.1 C42-2.1 C46-2.1 C48-2.1 C51-2.1 C52-2.1 C53-2.1 C54-2.1 C55-2.1 C59-2.1 C62-2.1 C64-2.1 C65-2.1 C67-2.1 C69-2.1 C89-2.1 R124-2.2 U5.C11(-1:CVDD) U5.D3(-1:CVDD) U5.D11(-1:CVDD) U5.F2(-1:CVDD) U5.G3(-1:CVDD) U5.H2(-1:CVDD) U5.K11(-1:CVDD) U5.K12(-1:RSV1) U5.L13(-1:RSV2) U5.M6(-1:CVDD) U5.M9(-1:CVDD) U5.N9(-1:CVDD)
DSP2_LDO_OUT_REG: R124-2.1 U5.A13(-1:DSP_LDOO)
N$83: R61-2.2 U5.A12(-1:RSV0)
N$84: R60-2.2 U5.B12(-1:RSV3)
N$85: R62-2.2 U5.B13(-1:RSV6)
N$86: C88-2.1 U5.C10(-1:BG_CAP)
N$87: R63-2.1 R64-2.2 U5.C13(-1:DSP_LDO_EN)
USB2_LDO [POWER]: R122-2.2 U5.D13(-1:USB_LDOO)
USB2_VDD1P3 [POWER]: C5-2.1 C60-2.1 C74-2.1 FB6-2.2 U5.E12(-1:USB_VDD1P3) U5.F14(-1:USB_VDD1P3) U5.K13(-1:USB_VDD1P3)
USB2_VDDA1P3 [POWER]: C2-2.1 C43-2.1 C49-2.1 FB4-2.2 U5.H12(-1:USB_VDDA1P3)
USB2_VDDA3P3: C4-2.1 C56-2.1 C63-2.1 FB5-2.2 U5.G12(-1:USB_VDDA3P3)
USB2_VDDPLL: C3-2.1 C50-2.1 C57-2.1 L3-2.2 U5.G13(-1:USB_VDDPLL)
USB_LDO_OUT2 [POWER]: FB4-2.1 FB6-2.1 R121-2.2 R122-2.1
VCC_1V3: R121-2.1 ; also sheet 2,3,6,8
VCC_1V8: C71-2.1 C75-2.1 C87-2.1 R63-2.2 U5.B10(-1:LDOI) U5.B14(-1:LDOI) U5.C14(-1:LDOI) ; also sheet 3,4,6
VCC_3V3_PWR: R97-2.2 ; also sheet 3,6
VCC_3V3_USB [POWER]: FB5-2.1 L3-2.1 ; also sheet 2,3,6,8
VDD_IO2_CPU [POWER]: C1-2.1 C28-2.1 C29-2.1 C30-2.1 C32-2.1 C45-2.1 C72-2.1 R97-2.1 U5.C6(-1:DVDDIO) U5.L4(-1:DVDDIO) U5.M3(-1:DVDDIO) U5.M4(-1:DVDDIO) U5.N8(-1:DVDDIO) U5.N11(-1:DVDDIO) U5.N14(-1:DVDDIO)

### Notes on the sheet
- Rezzonics
- DSP-2 POWER

## Sheet 10 of 12
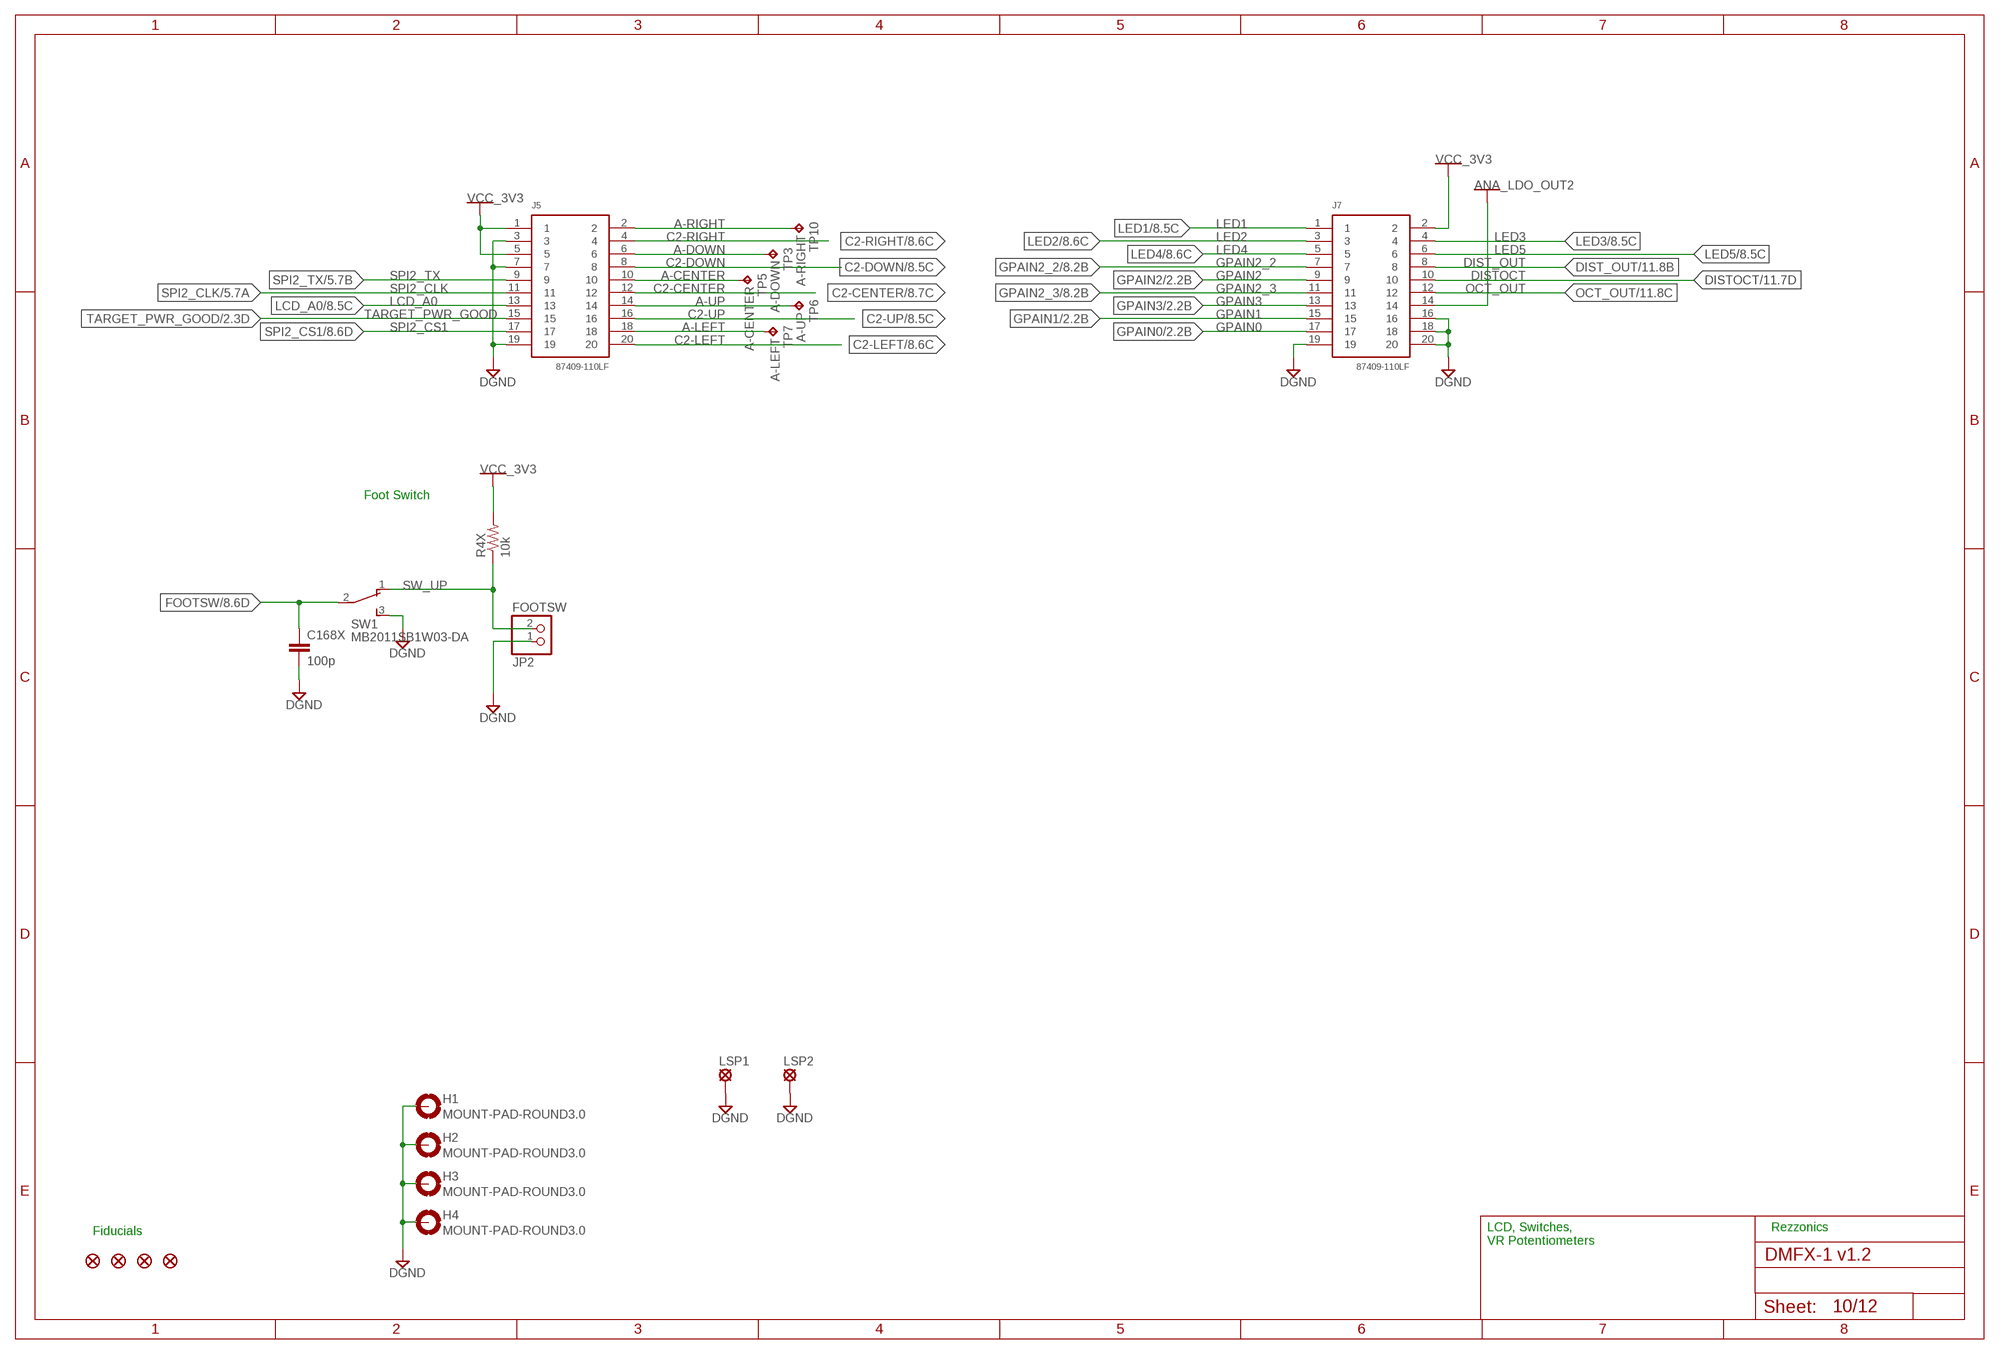
[diagram p9: schematic, sheet 10]

### Parts
C168X  100p  C-EUC0402K  [C0402K]
H1  MOUNT-PAD-ROUND3.0  [3,0-PAD]
H2  MOUNT-PAD-ROUND3.0  [3,0-PAD]
H3  MOUNT-PAD-ROUND3.0  [3,0-PAD]
H4  MOUNT-PAD-ROUND3.0  [3,0-PAD]
J5  87409-110LF  [87409-110LF]
J7  87409-110LF  [87409-110LF]
JP2  FOOTSW  PINHD-1X2  [1X02]
JP3  FIDUCIAL1X2.5  [FIDUCIAL-1X2.5]
JP6  FIDUCIAL1X2.5  [FIDUCIAL-1X2.5]
JP7  FIDUCIAL1X2.5  [FIDUCIAL-1X2.5]
JP8  FIDUCIAL1X2.5  [FIDUCIAL-1X2.5]
LSP1  LSP13  [LSP13]
LSP2  LSP13  [LSP13]
R4X  10k  RESISTOR0402-RES  [0402-RES]
SW1  MB2011SB1W03-DA  MB2011  [MB2011]
TP3  TPTP12R  [TP12R]
TP5  TPTP12R  [TP12R]
TP6  TPTP12R  [TP12R]
TP7  TPTP12R  [TP12R]
TP10  TPTP12R  [TP12R]

### Nets
A-CENTER: J5.10 TP5.TP
A-DOWN: J5.6 TP3.TP
A-LEFT: J5.18 TP7.TP
A-RIGHT: J5.2 TP10.TP
A-UP: J5.14 TP6.TP
ANA_LDO_OUT2: J7.14 ; also sheet 9
C2-CENTER: J5.12 ; also sheet 8
C2-DOWN: J5.8 ; also sheet 8
C2-LEFT: J5.20 ; also sheet 8
C2-RIGHT: J5.4 ; also sheet 8
C2-UP: J5.16 ; also sheet 8
DGND [POWER]: C168X.2 H1.B3,0(MOUNT) H2.B3,0(MOUNT) H3.B3,0(MOUNT) H4.B3,0(MOUNT) J5.3 J5.7 J5.19 J7.16 J7.18 J7.19 J7.20 JP2.1 LSP1.MP LSP2.MP SW1.3(S) ; also sheet 2,3,4,5,6,7,8,9,11,12
DIST_OUT: J7.8 ; also sheet 11
DISTOCT: J7.10 ; also sheet 11
FOOTSW: C168X.1 SW1.2(P) ; also sheet 8
GPAIN0: J7.17 ; also sheet 2
GPAIN1: J7.15 ; also sheet 2
GPAIN2: J7.9 ; also sheet 2
GPAIN2_2: J7.7 ; also sheet 8
GPAIN2_3: J7.11 ; also sheet 8
GPAIN3: J7.13 ; also sheet 2
LCD_A0: J5.13 ; also sheet 8
LED1: J7.1 ; also sheet 8
LED2: J7.3 ; also sheet 8
LED3: J7.4 ; also sheet 8
LED4: J7.5 ; also sheet 8
LED5: J7.6 ; also sheet 8
OCT_OUT: J7.12 ; also sheet 11
SPI2_CLK: J5.11 ; also sheet 5,8
SPI2_CS1: J5.17 ; also sheet 8
SPI2_TX: J5.9 ; also sheet 5,8
SW_UP: JP2.2 R4X.1 SW1.1(O)
TARGET_PWR_GOOD: J5.15 ; also sheet 2,4,6,7,8
VCC_3V3 [POWER]: J5.1 J5.5 J7.2 R4X.2 ; also sheet 4,5,6

### Notes on the sheet
- Foot Switch
- LCD, Switches,
  VR Potentiometers
- Rezzonics
- Fiducials

## Sheet 11 of 12
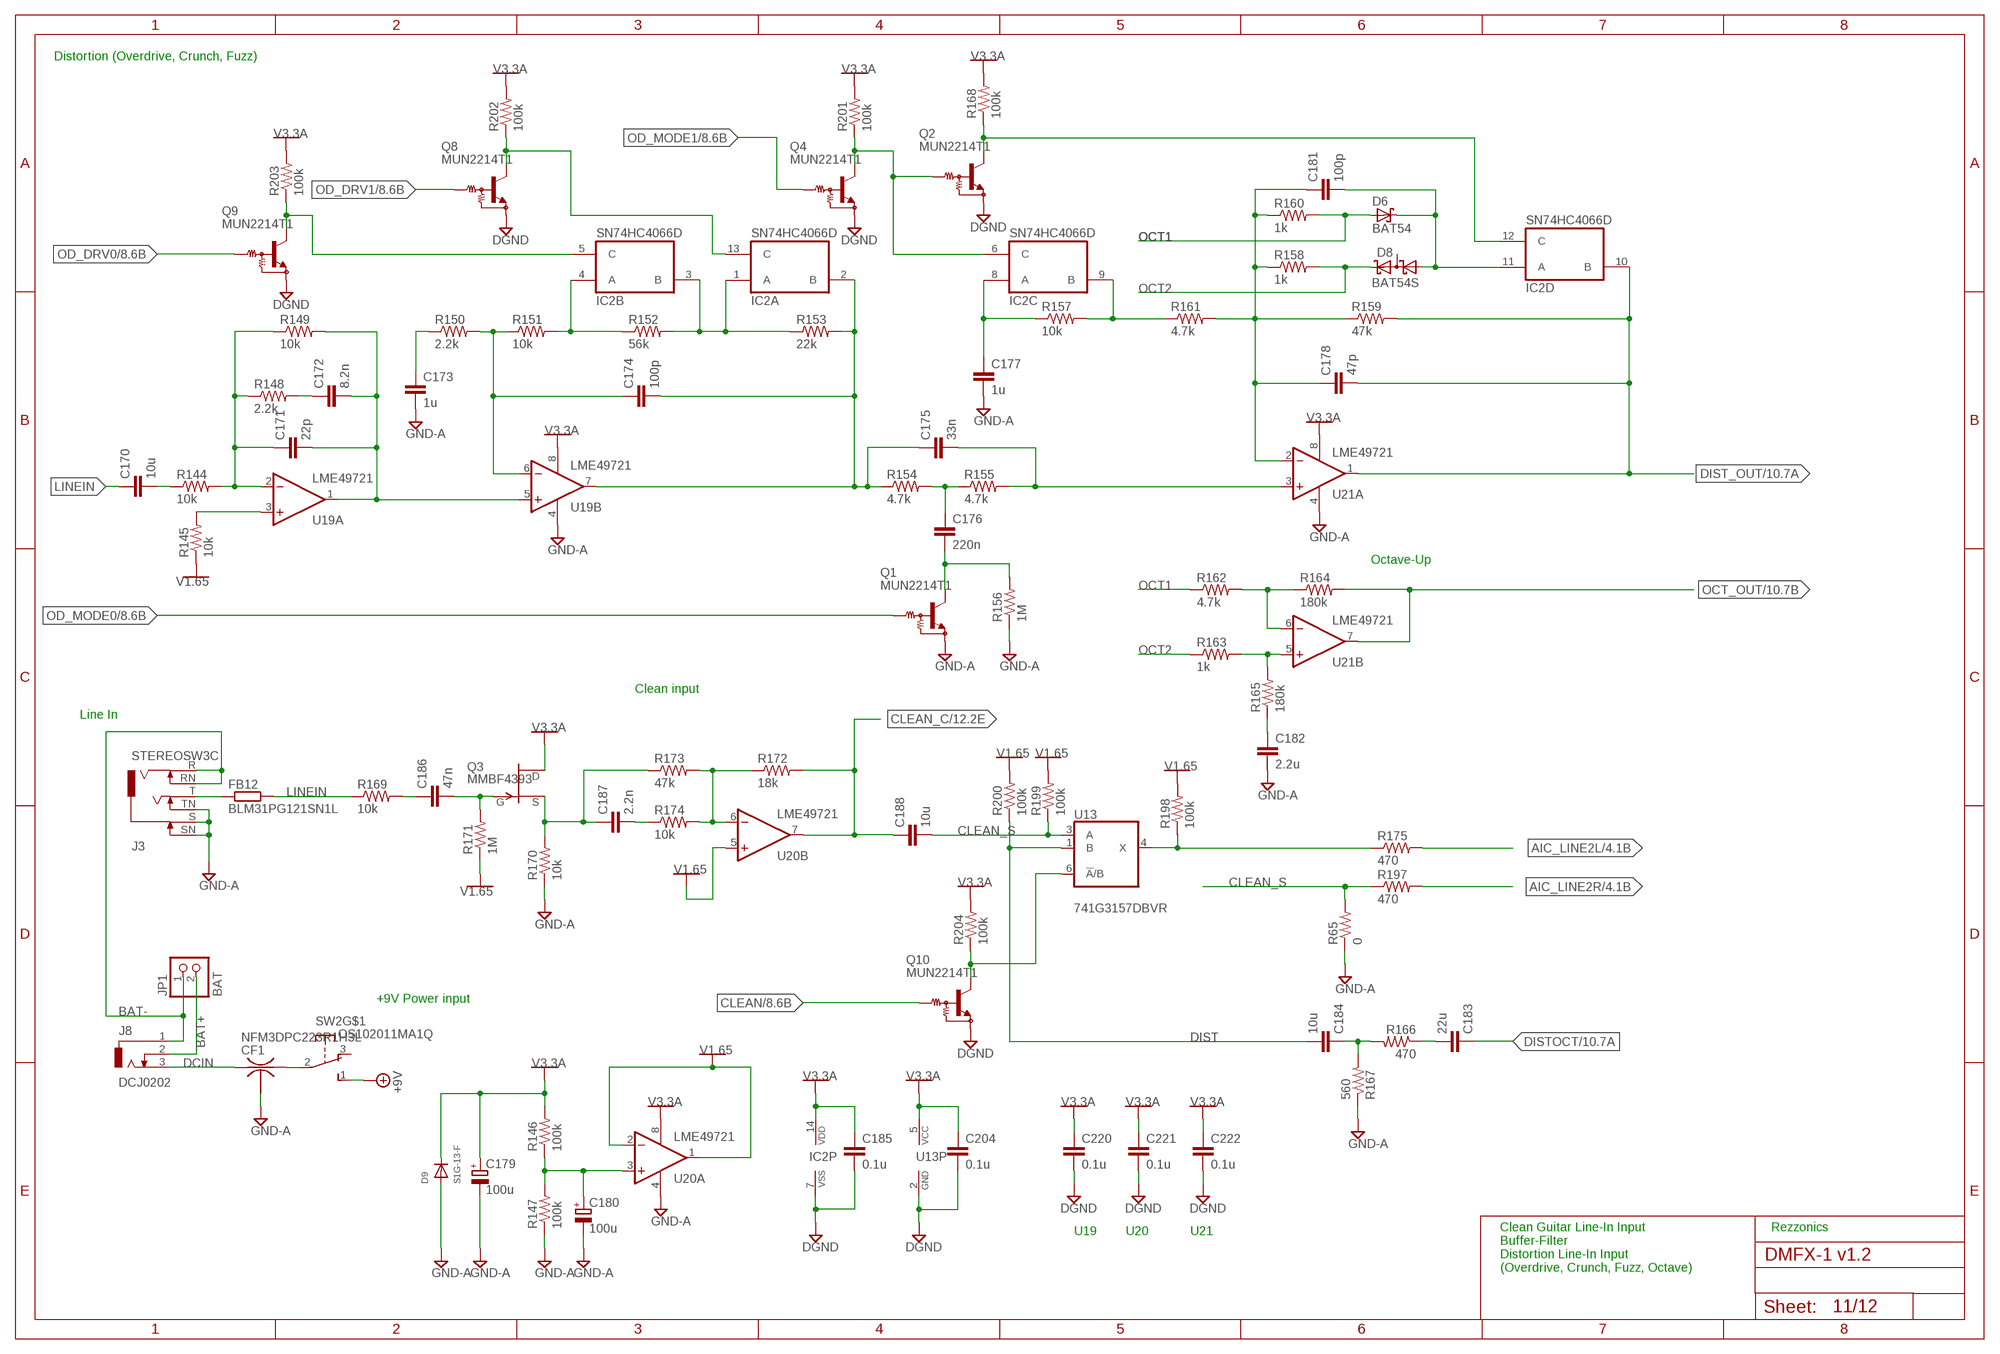
[diagram p10: schematic, sheet 11]

### Parts
C170  10u  C-EUC0805K  [C0805K]
C171  22p  CAP0402-CAP  [0402-CAP]
C172  8.2n  CAP0402-CAP  [0402-CAP]
C173  1u  CAP0402-CAP  [0402-CAP]
C174  100p  CAP0402-CAP  [0402-CAP]
C175  33n  CAP0402-CAP  [0402-CAP]
C176  220n  CAP0402-CAP  [0402-CAP]
C177  1u  CAP0402-CAP  [0402-CAP]
C178  47p  CAP0402-CAP  [0402-CAP]
C179  100u  CPOL-EUD  [PANASONIC_D]
C180  100u  CPOL-EUD  [PANASONIC_D]
C181  100p  CAP0402-CAP  [0402-CAP]
C182  2.2u  CAP0402-CAP  [0402-CAP]
C183  22u  C-EUC1206K  [C1206K]
C184  10u  C-EUC0805K  [C0805K]
C185  0.1u  C-EUC0402K  [C0402K]
C186  47n  CAP0402-CAP  [0402-CAP]
C187  2.2n  CAP0402-CAP  [0402-CAP]
C188  10u  C-EUC0805K  [C0805K]
C204  0.1u  C-EUC0402K  [C0402K]
C220  0.1u  C-EUC0402K  [C0402K]
C221  0.1u  C-EUC0402K  [C0402K]
C222  0.1u  C-EUC0402K  [C0402K]
CF1  NFM3DPC223R1H3L  NFM3DC  [NFM3DC]
D6  BAT54  [SOT23]
D8  BAT54S  [SOT23]
D9  S1G-13-F  DIODESMA  [SMADIODE]
FB12  BLM31PG121SN1L  R-EU_R1206  [R1206]
IC2  SN74HC4066D  4066D  [SO14]
J3  STEREOSW3C  [NEUTRIK-NMJ6HCD2]
J8  DCJ0202  [DCJ0202]
JP1  BAT  PINHD-1X2  [1X02]
Q1  MUN2214T1  [SC59-BEC]
Q2  MUN2214T1  [SC59-BEC]
Q3  MMBF4393  SST5486  [SOT23]
Q4  MUN2214T1  [SC59-BEC]
Q8  MUN2214T1  [SC59-BEC]
Q9  MUN2214T1  [SC59-BEC]
Q10  MUN2214T1  [SC59-BEC]
R65  0  RESISTOR0402-RES  [0402-RES]
R144  10k  RESISTOR0402-RES  [0402-RES]
R145  10k  RESISTOR0402-RES  [0402-RES]
R146  100k  RESISTOR0402-RES  [0402-RES]
R147  100k  RESISTOR0402-RES  [0402-RES]
R148  2.2k  RESISTOR0402-RES  [0402-RES]
R149  10k  RESISTOR0402-RES  [0402-RES]
R150  2.2k  RESISTOR0402-RES  [0402-RES]
R151  10k  RESISTOR0402-RES  [0402-RES]
R152  56k  RESISTOR0402-RES  [0402-RES]
R153  22k  RESISTOR0402-RES  [0402-RES]
R154  4.7k  RESISTOR0402-RES  [0402-RES]
R155  4.7k  RESISTOR0402-RES  [0402-RES]
R156  1M  RESISTOR0402-RES  [0402-RES]
R157  10k  RESISTOR0402-RES  [0402-RES]
R158  1k  RESISTOR0402-RES  [0402-RES]
R159  47k  RESISTOR0402-RES  [0402-RES]
R160  1k  RESISTOR0402-RES  [0402-RES]
R161  4.7k  RESISTOR0402-RES  [0402-RES]
R162  4.7k  RESISTOR0402-RES  [0402-RES]
R163  1k  RESISTOR0402-RES  [0402-RES]
R164  180k  RESISTOR0402-RES  [0402-RES]
R165  180k  RESISTOR0402-RES  [0402-RES]
R166  470  RESISTOR0402-RES  [0402-RES]
R167  560  RESISTOR0402-RES  [0402-RES]
R168  100k  RESISTOR0402-RES  [0402-RES]
R169  10k  RESISTOR0402-RES  [0402-RES]
R170  10k  RESISTOR0402-RES  [0402-RES]
R171  1M  RESISTOR0402-RES  [0402-RES]
R172  18k  RESISTOR0402-RES  [0402-RES]
R173  47k  RESISTOR0402-RES  [0402-RES]
R174  10k  RESISTOR0402-RES  [0402-RES]
R175  470  RESISTOR0402-RES  [0402-RES]
R197  470  RESISTOR0402-RES  [0402-RES]
R198  100k  RESISTOR0402-RES  [0402-RES]
R199  100k  RESISTOR0402-RES  [0402-RES]
R200  100k  RESISTOR0402-RES  [0402-RES]
R201  100k  RESISTOR0402-RES  [0402-RES]
R202  100k  RESISTOR0402-RES  [0402-RES]
R203  100k  RESISTOR0402-RES  [0402-RES]
R204  100k  RESISTOR0402-RES  [0402-RES]
SW2  OS102011MA1Q  [OS102011MA1Q]
U13  741G3157DBVR  [DBV_R-PDSO-G6]
U19  LME49721  RC4559D  [SO08]
U20  LME49721  RC4559D  [SO08]
U21  LME49721  RC4559D  [SO08]

### Nets
AIC_LINE2L: R175.2 ; also sheet 4
AIC_LINE2R: R197.2 ; also sheet 4
BAT+ [USB]: J8.2 JP1.2
BAT- [USB]: J3.R J3.RN J8.1 JP1.1
CLEAN: Q10.B ; also sheet 8
CLEAN_C: C188.1 R172.2 U20.7(B:OUT) ; also sheet 12
CLEAN_S: C188.2 R65.2 R197.1 R199.1 U13.3(A)
DCIN: CF1.1 J8.3
DGND [POWER]: C185.2 C204.2 C220.2 C221.2 C222.2 IC2.7(P:VSS) Q2.E Q4.E Q8.E Q9.E Q10.E U13.2(GND) ; also sheet 2,3,4,5,6,7,8,9,10,12
DIST: C184.2 R200.1 U13.1(B)
DIST_OUT: C178.2 IC2.10(D:B) R159.2 U21.1(A:OUT) ; also sheet 10
DISTOCT: C183.1 ; also sheet 10
GND-A [POWER]: C173.2 C177.2 C179.- C180.- C182.2 CF1.2@1 D9.A J3.S J3.SN J3.TN Q1.E R65.1 R147.1 R156.1 R167.1 R170.1 U19.4(P:V-) U20.4(P:V-) U21.4(P:V-) ; also sheet 4,12
LINEIN: C170.1 FB12.2 R169.1
N$2: C170.2 R144.1
N$19: C171.1 R144.2 R148.1 R149.1 U19.2(A:-IN)
N$88: R145.2 U19.3(A:+IN)
N$89: C186.1 R169.2
N$90: C172.1 R148.2
N$91: C171.2 C172.2 R149.2 U19.1(A:OUT) U19.5(B:+IN)
N$102: C173.1 R150.1
N$103: C174.1 R150.2 R151.1 U19.6(B:-IN)
N$104: C174.2 C175.1 IC2.2(A:B) R153.2 R154.1 U19.7(B:OUT)
N$105: IC2.1(A:A) IC2.3(B:B) R152.2 R153.1
N$106: IC2.4(B:A) R151.2 R152.1
N$107: C176.1 R154.2 R155.1
N$108: C175.2 R155.2 U21.3(A:+IN)
N$109: C176.2 Q1.C R156.2
N$111: C177.1 IC2.8(C:A) R157.1
N$112: C178.1 C181.1 R158.1 R159.1 R160.1 R161.2 U21.2(A:-IN)
N$113: R163.2 R165.2 U21.5(B:+IN)
N$115: C182.1 R165.1
N$116: IC2.9(C:B) R157.2 R161.1
N$117: C181.2 D6.3(C) D8.1(A1) IC2.11(D:A)
N$118: R162.2 R164.1 U21.6(B:-IN)
N$120: C183.2 R166.1
N$121: C184.1 R166.2 R167.2
N$122: FB12.1 J3.T
N$124: IC2.12(D:C) Q2.C R168.1
N$125: C180.+ R146.1 R147.2 U20.3(A:+IN)
N$126: C186.2 Q3.3(G) R171.2
N$127: IC2.5(B:C) Q9.C R203.1
N$128: C187.2 R174.1
N$130: R172.1 R173.2 R174.2 U20.6(B:-IN)
N$131: C187.1 Q3.2(S) R170.2 R173.1
N$154: CF1.3 SW2.2(P)
N$157: IC2.13(A:C) Q8.C R202.1
N$160: R175.1 R198.1 U13.4(X)
N$161: IC2.6(C:C) Q2.B Q4.C R201.1
N$162: Q10.C R204.1 U13.6(!A!/B)
OCT1: D6.1(A) R160.2 R162.1
OCT2: D8.2(C2) R158.2 R163.1
OCT_OUT: R164.2 U21.7(B:OUT) ; also sheet 10
OD_DRV0: Q9.B ; also sheet 8
OD_DRV1: Q8.B ; also sheet 8
OD_MODE0: Q1.B ; also sheet 8
OD_MODE1: Q4.B ; also sheet 8
V1.65: R145.1 R171.1 R198.2 R199.2 R200.2 U20.1(A:OUT) U20.2(A:-IN) U20.5(B:+IN) ; also sheet 12
V3.3A: C179.+ C185.1 C204.1 C220.1 C221.1 C222.1 D9.C IC2.14(P:VDD) Q3.1(D) R146.2 R168.2 R201.2 R202.2 R203.2 R204.2 U13.5(VCC) U19.8(P:V+) U20.8(P:V+) U21.8(P:V+) ; also sheet 4,12
V3.3AA [POWER]: SW2.1(S) ; supply symbol labelled +9V ; also sheet 7
Unconnected: CF1.2@2 D8.3(C1A2) SW2.3(O) SW2.MT1(MT) SW2.MT2(MT)

### Notes on the sheet
- Distortion (Overdrive, Crunch, Fuzz)
- Octave-Up
- Clean input
- Line In
- +9V Power input
- Clean Guitar Line-In Input
  Buffer-Filter
  Distortion Line-In Input
  (Overdrive, Crunch, Fuzz, Octave)
- Rezzonics
- U19 | U20 | U21

## Sheet 12 of 12
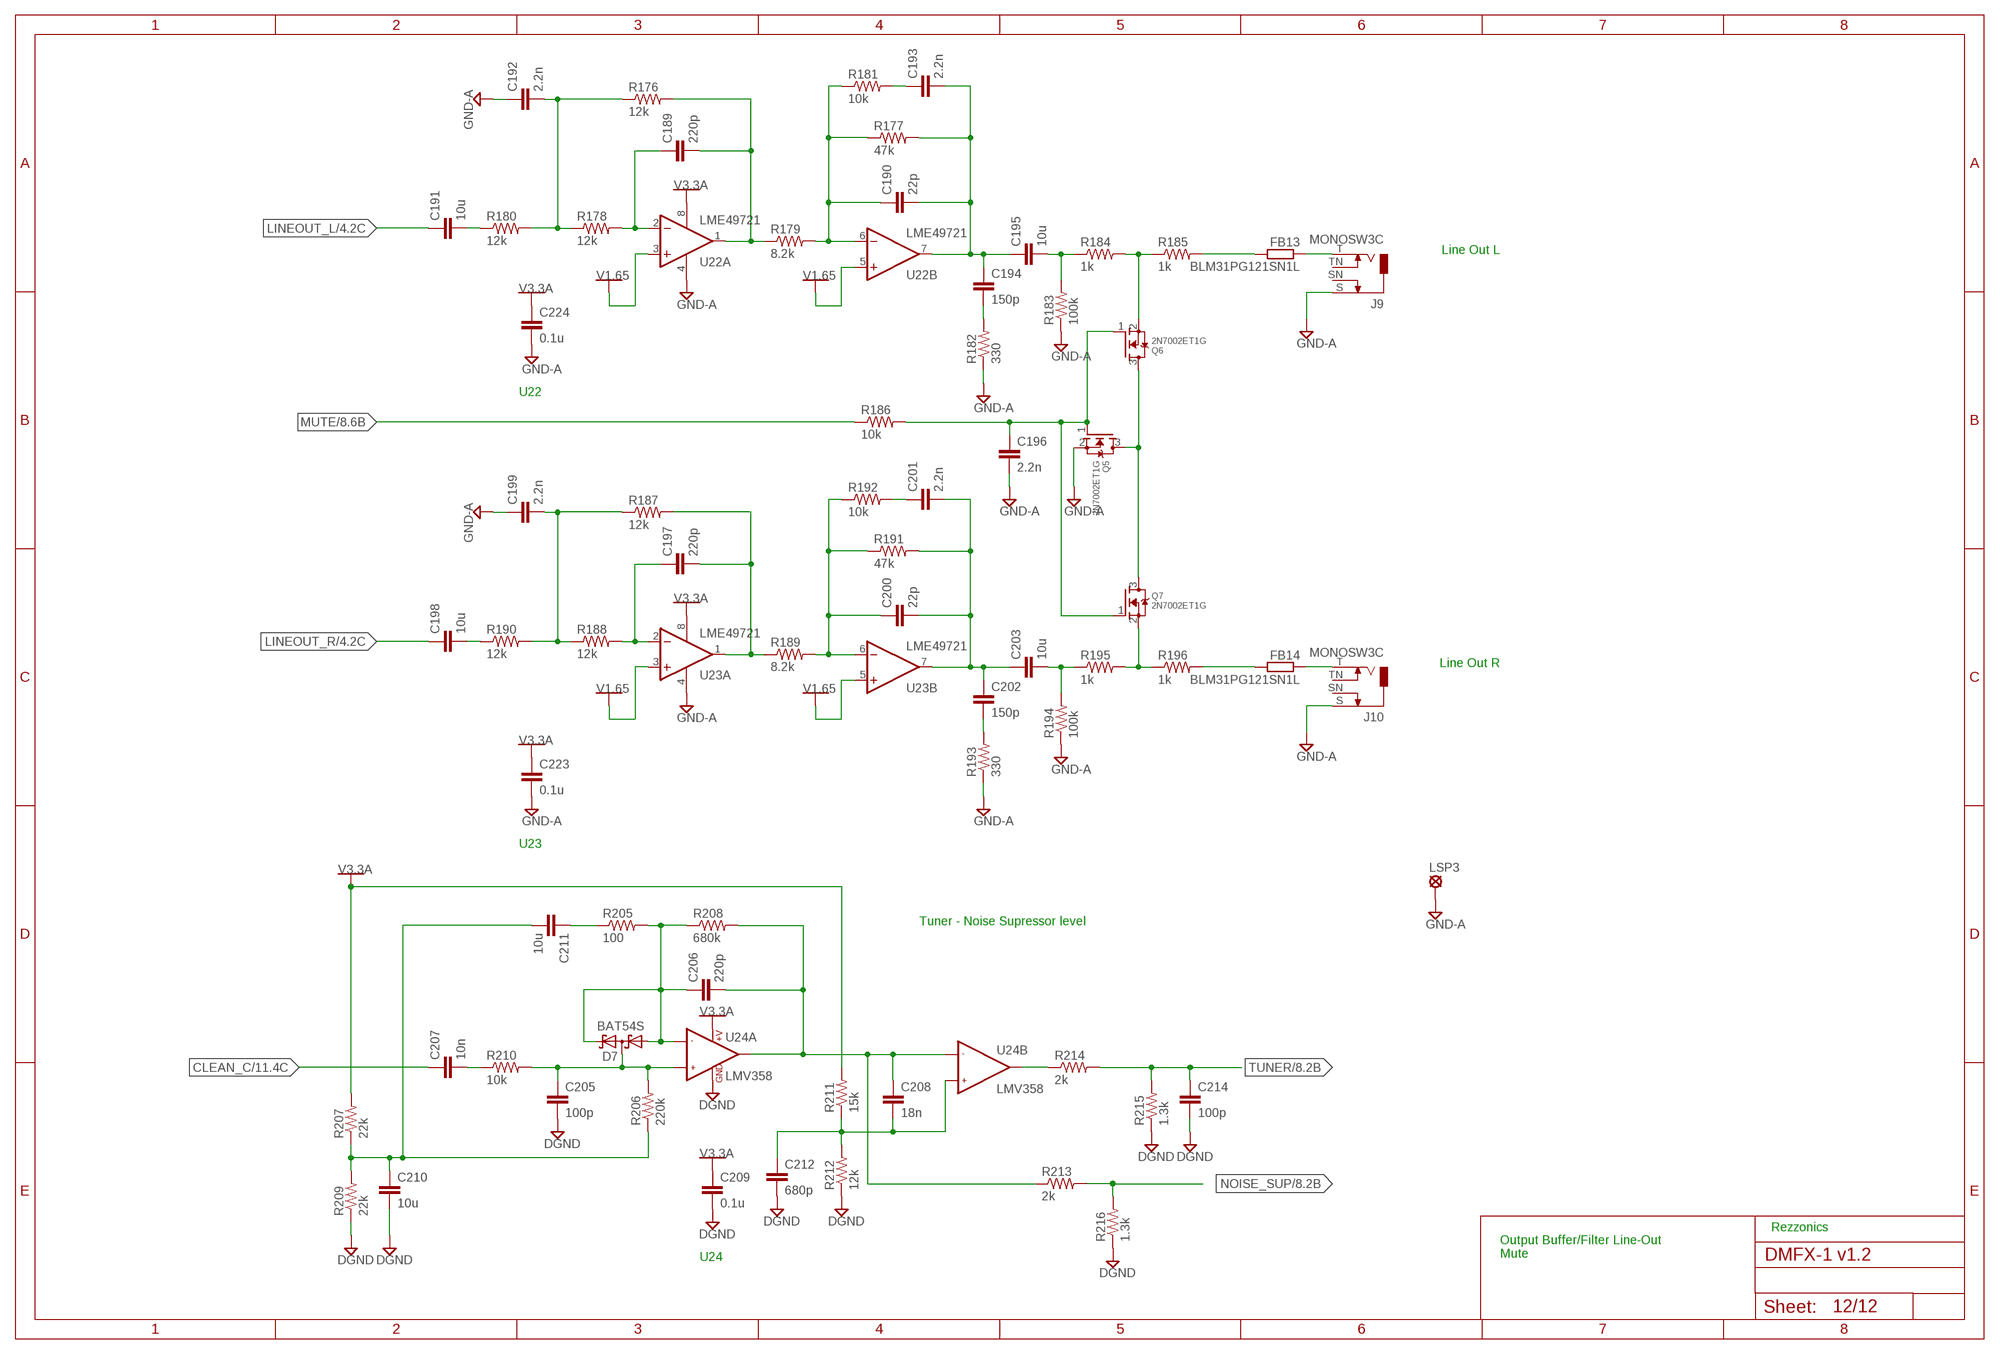
[diagram p11: schematic, sheet 12]

### Parts
C189  220p  CAP0402-CAP  [0402-CAP]
C190  22p  CAP0402-CAP  [0402-CAP]
C191  10u  C-EUC0805K  [C0805K]
C192  2.2n  CAP0402-CAP  [0402-CAP]
C193  2.2n  CAP0402-CAP  [0402-CAP]
C194  150p  CAP0402-CAP  [0402-CAP]
C195  10u  C-EUC0805K  [C0805K]
C196  2.2n  CAP0402-CAP  [0402-CAP]
C197  220p  CAP0402-CAP  [0402-CAP]
C198  10u  C-EUC0805K  [C0805K]
C199  2.2n  CAP0402-CAP  [0402-CAP]
C200  22p  CAP0402-CAP  [0402-CAP]
C201  2.2n  CAP0402-CAP  [0402-CAP]
C202  150p  CAP0402-CAP  [0402-CAP]
C203  10u  C-EUC0805K  [C0805K]
C205  100p  CAP0402-CAP  [0402-CAP]
C206  220p  CAP0402-CAP  [0402-CAP]
C207  10n  CAP0402-CAP  [0402-CAP]
C208  18n  CAP0402-CAP  [0402-CAP]
C209  0.1u  CAP0402-CAP  [0402-CAP]
C210  10u  C-EUC0805K  [C0805K]
C211  10u  C-EUC0805K  [C0805K]
C212  680p  CAP0402-CAP  [0402-CAP]
C214  100p  CAP0402-CAP  [0402-CAP]
C223  0.1u  CAP0402-CAP  [0402-CAP]
C224  0.1u  CAP0402-CAP  [0402-CAP]
D7  BAT54S  [SOT23]
FB13  BLM31PG121SN1L  R-EU_R1206  [R1206]
FB14  BLM31PG121SN1L  R-EU_R1206  [R1206]
J9  MONOSW3C  [NEUTRIK-NMJ4HCD2]
J10  MONOSW3C  [NEUTRIK-NMJ4HCD2]
LSP3  LSP13  [LSP13]
Q5  2N7002ET1G  MOSFET-NREFLOW  [SOT23]
Q6  2N7002ET1G  MOSFET-NREFLOW  [SOT23]
Q7  2N7002ET1G  MOSFET-NREFLOW  [SOT23]
R176  12k  RESISTOR0402-RES  [0402-RES]
R177  47k  RESISTOR0402-RES  [0402-RES]
R178  12k  RESISTOR0402-RES  [0402-RES]
R179  8.2k  RESISTOR0402-RES  [0402-RES]
R180  12k  RESISTOR0402-RES  [0402-RES]
R181  10k  RESISTOR0402-RES  [0402-RES]
R182  330  RESISTOR0402-RES  [0402-RES]
R183  100k  RESISTOR0402-RES  [0402-RES]
R184  1k  RESISTOR0402-RES  [0402-RES]
R185  1k  RESISTOR0402-RES  [0402-RES]
R186  10k  RESISTOR0402-RES  [0402-RES]
R187  12k  RESISTOR0402-RES  [0402-RES]
R188  12k  RESISTOR0402-RES  [0402-RES]
R189  8.2k  RESISTOR0402-RES  [0402-RES]
R190  12k  RESISTOR0402-RES  [0402-RES]
R191  47k  RESISTOR0402-RES  [0402-RES]
R192  10k  RESISTOR0402-RES  [0402-RES]
R193  330  RESISTOR0402-RES  [0402-RES]
R194  100k  RESISTOR0402-RES  [0402-RES]
R195  1k  RESISTOR0402-RES  [0402-RES]
R196  1k  RESISTOR0402-RES  [0402-RES]
R205  100  RESISTOR0402-RES  [0402-RES]
R206  220k  RESISTOR0402-RES  [0402-RES]
R207  22k  RESISTOR0402-RES  [0402-RES]
R208  680k  RESISTOR0402-RES  [0402-RES]
R209  22k  RESISTOR0402-RES  [0402-RES]
R210  10k  RESISTOR0402-RES  [0402-RES]
R211  15k  RESISTOR0402-RES  [0402-RES]
R212  12k  RESISTOR0402-RES  [0402-RES]
R213  2k  RESISTOR0402-RES  [0402-RES]
R214  2k  RESISTOR0402-RES  [0402-RES]
R215  1.3k  RESISTOR0402-RES  [0402-RES]
R216  1.3k  RESISTOR0402-RES  [0402-RES]
U22  LME49721  RC4559D  [SO08]
U23  LME49721  RC4559D  [SO08]
U24  LMV358  [SO08]

### Nets
CLEAN_C: C207.1 ; also sheet 11
DGND [POWER]: C205.2 C209.2 C210.2 C212.2 C214.2 R209.1 R212.1 R215.1 R216.1 U24.4(A:GND) ; also sheet 2,3,4,5,6,7,8,9,10,11
GND-A [POWER]: C192.1 C196.2 C199.1 C223.2 C224.2 J9.S J10.S LSP3.MP Q5.2(S) R182.1 R183.1 R193.1 R194.1 U22.4(P:V-) U23.4(P:V-) ; also sheet 4,11
LINEOUT_L: C191.1 ; also sheet 4
LINEOUT_R: C198.1 ; also sheet 4
MUTE: R186.1 ; also sheet 8
N$63: C206.1 D7.1(A1) D7.2(C2) R205.2 R208.1 U24.2(A:-IN1)
N$129: C190.1 R177.1 R179.2 R181.1 U22.6(B:-IN)
N$133: C192.2 R176.1 R178.1 R180.2
N$134: C190.2 C193.2 C194.1 C195.1 R177.2 U22.7(B:OUT)
N$135: C189.2 R176.2 R179.1 U22.1(A:OUT)
N$136: C193.1 R181.2
N$137: C191.2 R180.1
N$138: C189.1 R178.2 U22.2(A:-IN)
N$139: C194.2 R182.2
N$140: Q5.3(D) Q6.3(D) Q7.3(D)
N$141: C195.2 R183.2 R184.1
N$142: Q6.2(S) R184.2 R185.1
N$143: FB13.1 J9.T
N$144: C196.1 Q5.1(G) Q6.1(G) Q7.1(G) R186.2
N$145: FB13.2 R185.2
N$146: C199.2 R187.1 R188.1 R190.2
N$147: C197.2 R187.2 R189.1 U23.1(A:OUT)
N$148: C198.2 R190.1
N$149: C197.1 R188.2 U23.2(A:-IN)
N$150: C200.1 R189.2 R191.1 R192.1 U23.6(B:-IN)
N$151: C200.2 C201.2 C202.1 C203.1 R191.2 U23.7(B:OUT)
N$152: C201.1 R192.2
N$153: C202.2 R193.2
N$155: C203.2 R194.2 R195.1
N$156: Q7.2(S) R195.2 R196.1
N$158: FB14.1 J10.T
N$159: FB14.2 R196.2
N$163: C206.2 C208.1 R208.2 R213.1 U24.1(A:OUT1) U24.6(B:-IN2)
N$165: C210.1 C211.2 R206.1 R207.1 R209.2
N$166: C207.2 R210.1
N$167: C205.1 D7.3(C1A2) R206.2 R210.2 U24.3(A:+IN1)
N$168: C211.1 R205.1
N$170: C208.2 C212.1 R211.1 R212.2 U24.5(B:+IN2)
N$172: R214.1 U24.7(B:OUT2)
NOISE_SUP: R213.2 R216.2 ; also sheet 8
TUNER: C214.1 R214.2 R215.2 ; also sheet 8
V1.65: U22.3(A:+IN) U22.5(B:+IN) U23.3(A:+IN) U23.5(B:+IN) ; also sheet 11
V3.3A: C209.1 C223.1 C224.1 R207.2 R211.2 U22.8(P:V+) U23.8(P:V+) U24.8(A:+V) ; also sheet 4,11
Unconnected: J9.SN J9.TN J10.SN J10.TN

### Notes on the sheet
- Line Out L
- U22
- Line Out R
- U23
- Tuner - Noise Supressor level
- Rezzonics
- Output Buffer/Filter Line-Out
  Mute
- U24